# EAGLE schematic rev02 (EAGLE 7.5.0), part 2 of 2
## Sheet 19 of 26: FPGA voltage regulators
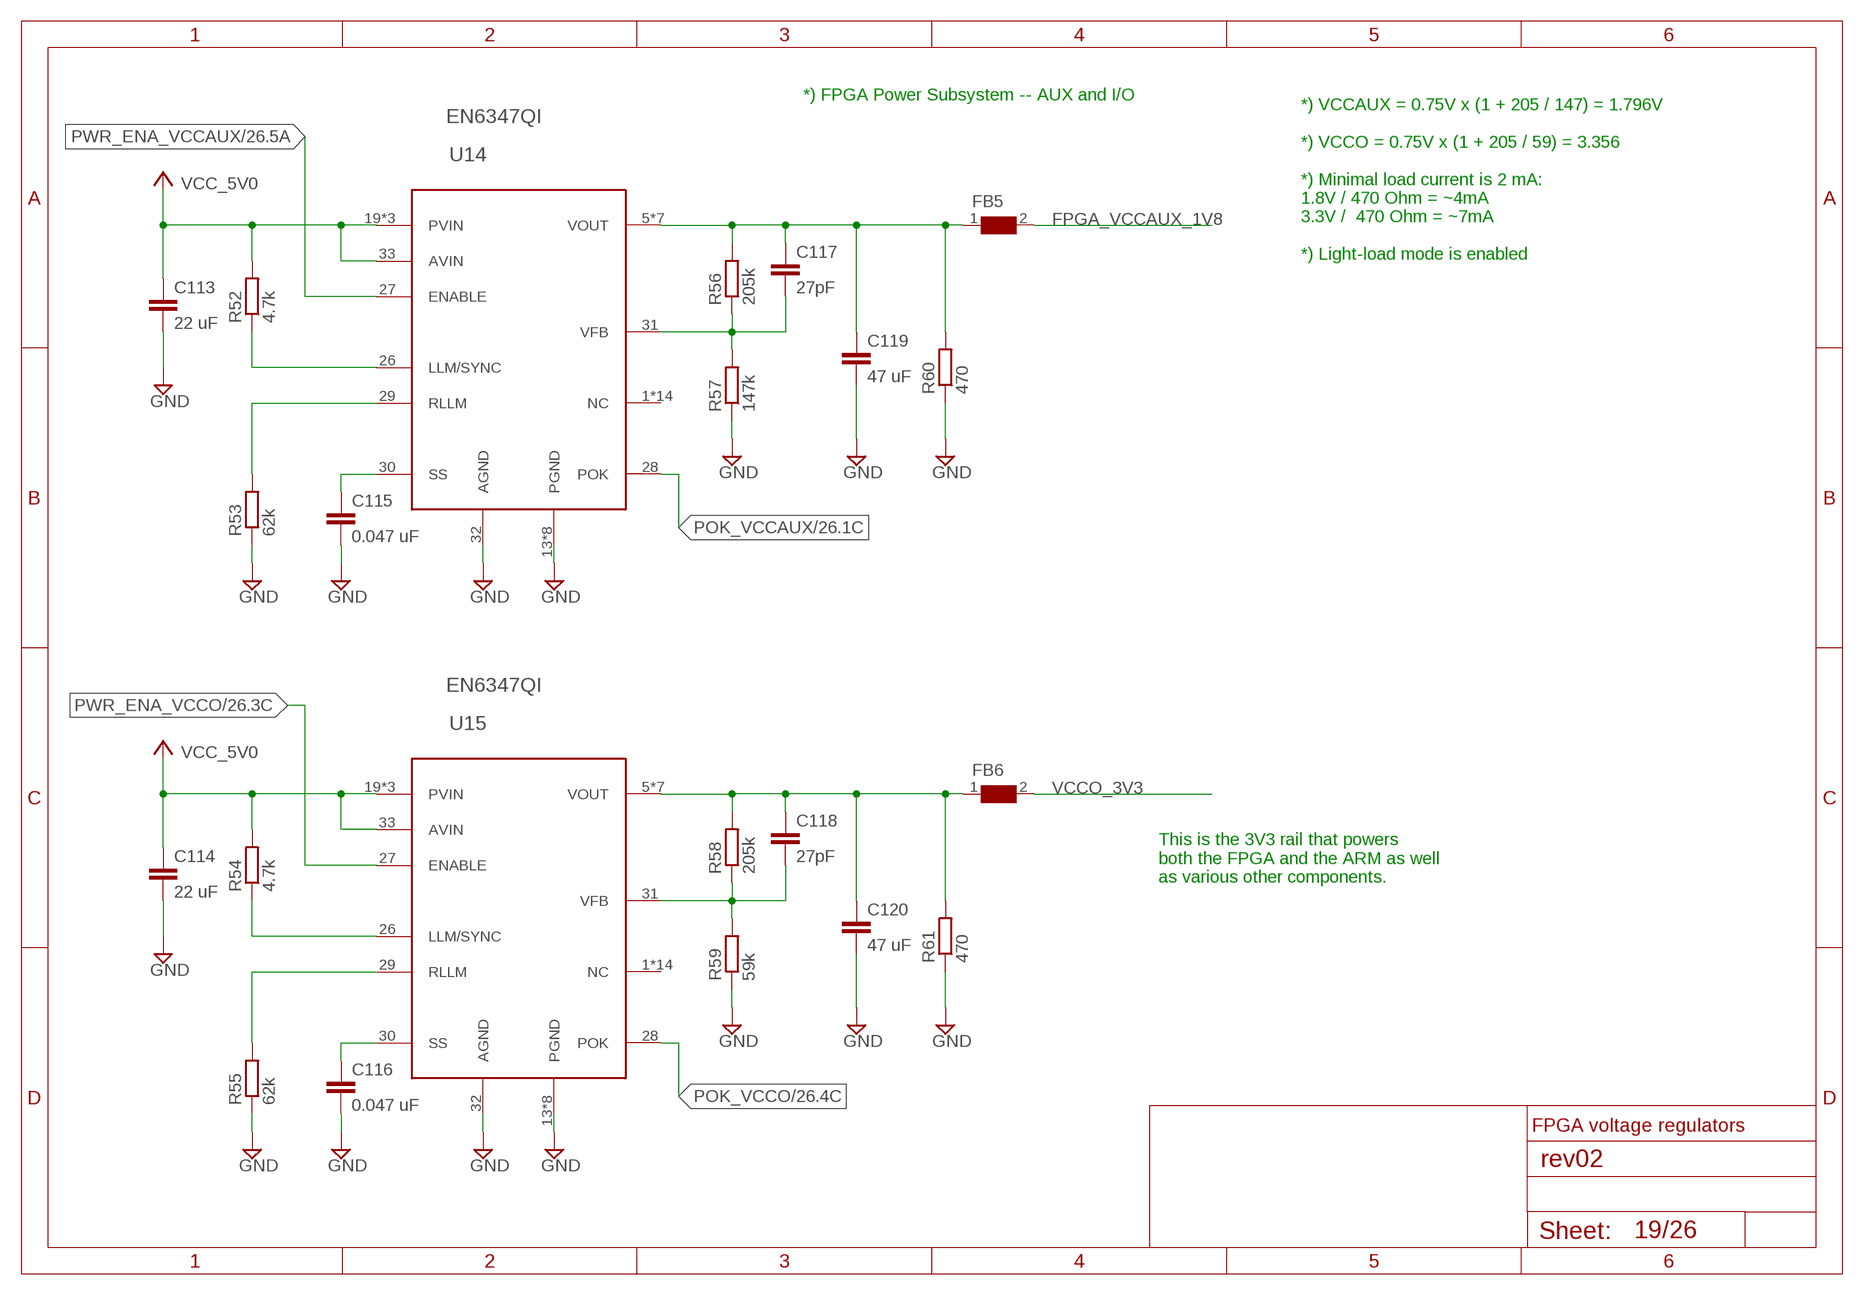
[diagram p18: schematic, sheet 19]

### Parts
C113  22 uF  C-EUC1210  [C1210]
C114  22 uF  C-EUC1210  [C1210]
C115  0.047 uF  C-EUC0402  [C0402]
C116  0.047 uF  C-EUC0402  [C0402]
C117  27pF  C-EUC0402  [C0402]
C118  27pF  C-EUC0402  [C0402]
C119  47 uF  C-EUC1210  [C1210]
C120  47 uF  C-EUC1210  [C1210]
FB5  0  BLM31PG330SN1_1206  [1206]
FB6  0  BLM31PG330SN1_1206  [1206]
R52  4.7k  R-EU_R0402  [R0402]
R53  62k  R-EU_R0402  [R0402]
R54  4.7k  R-EU_R0402  [R0402]
R55  62k  R-EU_R0402  [R0402]
R56  205k  R-EU_R0402  [R0402]
R57  147k  R-EU_R0402  [R0402]
R58  205k  R-EU_R0402  [R0402]
R59  59k  R-EU_R0402  [R0402]
R60  470  R-EU_R0402  [R0402]
R61  470  R-EU_R0402  [R0402]
U14  EN6347QI  [QFN38_4X7X1.85]
U15  EN6347QI  [QFN38_4X7X1.85]

### Nets
FPGA_VCCAUX_1V8: FB5.2 ; also sheet 15,22,23
GND [Ground]: C113.2 C114.2 C115.2 C116.2 C119.2 C120.2 R53.1 R55.1 R57.1 R59.1 R60.1 R61.1 U14.13(PGND) U14.14(PGND) U14.15(PGND) U14.16(PGND) U14.17(PGND) U14.18(PGND) U14.32(AGND) U14.P$39(PGND) U14.P$40(PGND) U15.13(PGND) U15.14(PGND) U15.15(PGND) U15.16(PGND) U15.17(PGND) U15.18(PGND) U15.32(AGND) U15.P$39(PGND) U15.P$40(PGND) ; also sheet 2,3,4,5,7,8,9,10,11,12,13,14,15,16,20,22,23,24,25,26
N$35: C115.1 U14.30(SS)
N$36: R53.2 U14.29(RLLM)
N$37: R52.1 U14.26(LLM/SYNC)
N$38: C117.1 C119.1 FB5.1 R56.2 R60.2 U14.5(VOUT) U14.6(VOUT) U14.7(VOUT) U14.8(VOUT) U14.9(VOUT) U14.10(VOUT) U14.11(VOUT)
N$39: C117.2 R56.1 R57.2 U14.31(VFB)
N$40: C116.1 U15.30(SS)
N$41: R55.2 U15.29(RLLM)
N$42: R54.1 U15.26(LLM/SYNC)
N$43: C118.1 C120.1 FB6.1 R58.2 R61.2 U15.5(VOUT) U15.6(VOUT) U15.7(VOUT) U15.8(VOUT) U15.9(VOUT) U15.10(VOUT) U15.11(VOUT)
N$44: C118.2 R58.1 R59.2 U15.31(VFB)
POK_VCCAUX: U14.28(POK) ; also sheet 26
POK_VCCO: U15.28(POK) ; also sheet 26
PWR_ENA_VCCAUX: U14.27(ENABLE) ; also sheet 26
PWR_ENA_VCCO: U15.27(ENABLE) ; also sheet 26
VCC_5V0: C113.1 C114.1 R52.2 R54.2 U14.19(PVIN) U14.20(PVIN) U14.21(PVIN) U14.33(AVIN) U15.19(PVIN) U15.20(PVIN) U15.21(PVIN) U15.33(AVIN) ; supply symbol labelled VCC ; also sheet 2,25,26
VCCO_3V3: FB6.2 ; also sheet 3,4,5,7,8,9,10,11,12,14,16,17,18,20,21,24
Unconnected: U14.1(NC) U14.2(NC) U14.3(NC) U14.4(NC) U14.12(NC) U14.22(NC) U14.23(NC) U14.24(NC) U14.25(NC) U14.34(NC) U14.35(NC) U14.36(NC) U14.37(NC) U14.38(NC) U15.1(NC) U15.2(NC) U15.3(NC) U15.4(NC) U15.12(NC) U15.22(NC) U15.23(NC) U15.24(NC) U15.25(NC) U15.34(NC) U15.35(NC) U15.36(NC) U15.37(NC) U15.38(NC)

### Notes on the sheet
- *) FPGA Power Subsystem -- AUX and I/O
- *) VCCAUX = 0.75V x (1 + 205 / 147) = 1.796V
  
  *) VCCO = 0.75V x (1 + 205 / 59) = 3.356
  
  *) Minimal load current is 2 mA:
  1.8V / 470 Ohm = ~4mA
  3.3V /  470 Ohm = ~7mA
  
  *) Light-load mode is enabled
- This is the 3V3 rail that powers
  both the FPGA and the ARM as well
  as various other components.
- FPGA voltage regulators

## Sheet 20 of 26: FPGA GPIO
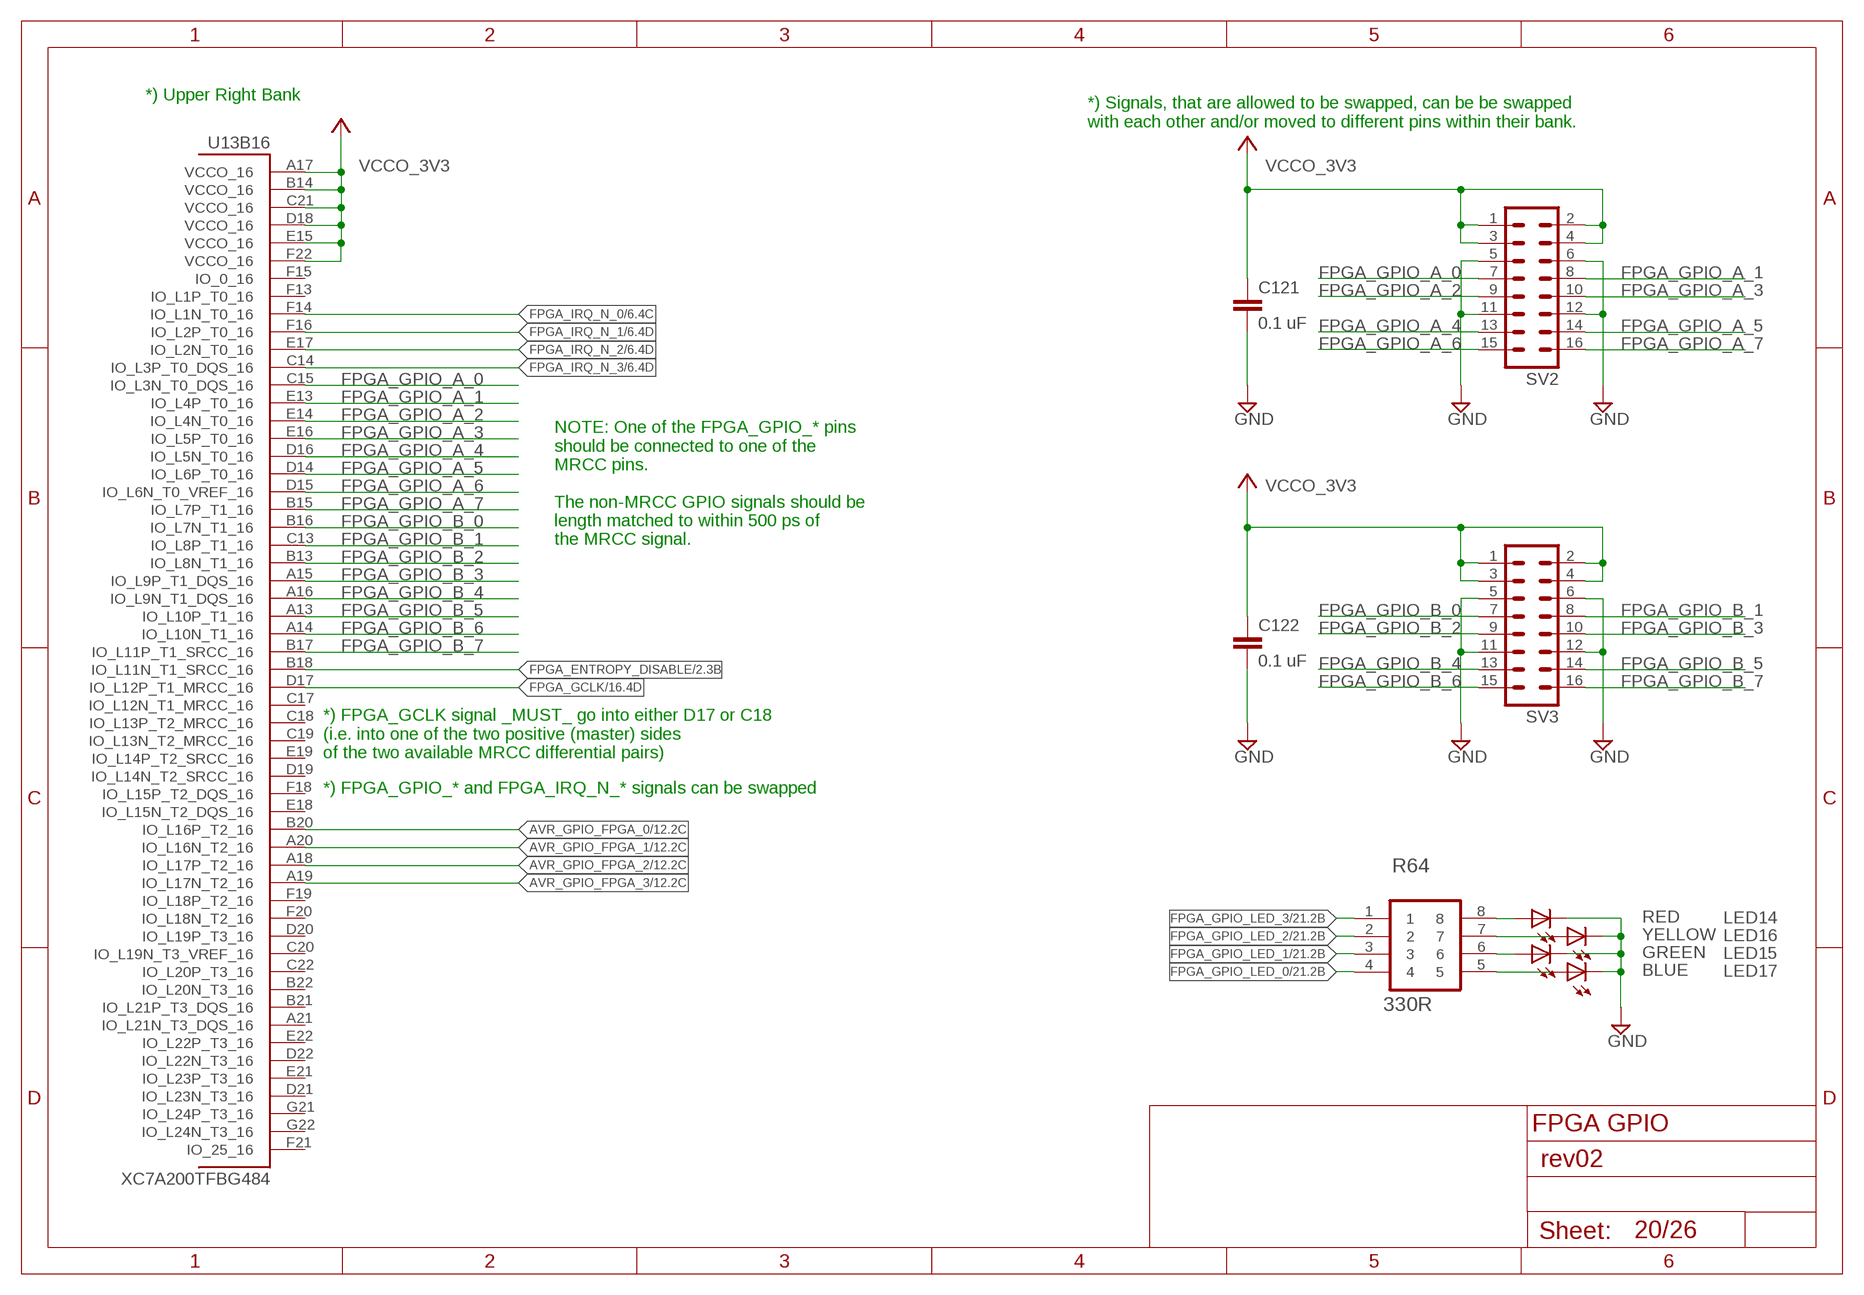
[diagram p19: schematic, sheet 20]

### Parts
C121  0.1 uF  C-EUC0402  [C0402]
C122  0.1 uF  C-EUC0402  [C0402]
LED14  RED  LEDCHIP-LED0603  [CHIP-LED0603]
LED15  GREEN  LEDCHIP-LED0603  [CHIP-LED0603]
LED16  YELLOW  LEDCHIP-LED0603  [CHIP-LED0603]
LED17  BLUE  LEDCHIP-LED0603  [CHIP-LED0603]
R64  330R  EXB38V331JV  [RESCAXE80P320X160X60-8N]
SV2  MA08-2  [MA08-2]
SV3  MA08-2  [MA08-2]

### Nets
FPGA_ENTROPY_DISABLE: U13.B18(B16:IO_L11N_T1_SRCC_16) ; also sheet 2
FPGA_GCLK: U13.D17(B16:IO_L12P_T1_MRCC_16) ; also sheet 16
FPGA_GPIO_A_0: SV2.7 U13.C15(B16:IO_L3N_T0_DQS_16)
FPGA_GPIO_A_1: SV2.8 U13.E13(B16:IO_L4P_T0_16)
FPGA_GPIO_A_2: SV2.9 U13.E14(B16:IO_L4N_T0_16)
FPGA_GPIO_A_3: SV2.10 U13.E16(B16:IO_L5P_T0_16)
FPGA_GPIO_A_4: SV2.13 U13.D16(B16:IO_L5N_T0_16)
FPGA_GPIO_A_5: SV2.14 U13.D14(B16:IO_L6P_T0_16)
FPGA_GPIO_A_6: SV2.15 U13.D15(B16:IO_L6N_T0_VREF_16)
FPGA_GPIO_A_7: SV2.16 U13.B15(B16:IO_L7P_T1_16)
FPGA_GPIO_B_0: SV3.7 U13.B16(B16:IO_L7N_T1_16)
FPGA_GPIO_B_1: SV3.8 U13.C13(B16:IO_L8P_T1_16)
FPGA_GPIO_B_2: SV3.9 U13.B13(B16:IO_L8N_T1_16)
FPGA_GPIO_B_3: SV3.10 U13.A15(B16:IO_L9P_T1_DQS_16)
FPGA_GPIO_B_4: SV3.13 U13.A16(B16:IO_L9N_T1_DQS_16)
FPGA_GPIO_B_5: SV3.14 U13.A13(B16:IO_L10P_T1_16)
FPGA_GPIO_B_6: SV3.15 U13.A14(B16:IO_L10N_T1_16)
FPGA_GPIO_B_7: SV3.16 U13.B17(B16:IO_L11P_T1_SRCC_16)
FPGA_GPIO_LED_0: R64.4 ; also sheet 21
FPGA_GPIO_LED_1: R64.3 ; also sheet 21
FPGA_GPIO_LED_2: R64.2 ; also sheet 21
FPGA_GPIO_LED_3: R64.1 ; also sheet 21
FPGA_IRQ_N_0: U13.F14(B16:IO_L1N_T0_16) ; also sheet 6
FPGA_IRQ_N_1: U13.F16(B16:IO_L2P_T0_16) ; also sheet 6
FPGA_IRQ_N_2: U13.E17(B16:IO_L2N_T0_16) ; also sheet 6
FPGA_IRQ_N_3: U13.C14(B16:IO_L3P_T0_DQS_16) ; also sheet 6
GND [Ground]: C121.2 C122.2 LED14.C LED15.C LED16.C LED17.C SV2.5 SV2.6 SV2.11 SV2.12 SV3.5 SV3.6 SV3.11 SV3.12 ; also sheet 2,3,4,5,7,8,9,10,11,12,13,14,15,16,19,22,23,24,25,26
N$27: LED17.A R64.5
N$28: LED15.A R64.6
N$29: LED16.A R64.7
N$30: LED14.A R64.8
VCCO_3V3: C121.1 C122.1 SV2.1 SV2.2 SV2.3 SV2.4 SV3.1 SV3.2 SV3.3 SV3.4 U13.A17(B16:VCCO_16) U13.B14(B16:VCCO_16) U13.C21(B16:VCCO_16) U13.D18(B16:VCCO_16) U13.E15(B16:VCCO_16) U13.F22(B16:VCCO_16) ; supply symbol labelled VCC ; also sheet 3,4,5,7,8,9,10,11,12,14,16,17,18,19,21,24
Unconnected: U13.A18(B16:IO_L17P_T2_16) U13.A19(B16:IO_L17N_T2_16) U13.A20(B16:IO_L16N_T2_16) U13.A21(B16:IO_L21N_T3_DQS_16) U13.B20(B16:IO_L16P_T2_16) U13.B21(B16:IO_L21P_T3_DQS_16) U13.B22(B16:IO_L20N_T3_16) U13.C17(B16:IO_L12N_T1_MRCC_16) U13.C18(B16:IO_L13P_T2_MRCC_16) U13.C19(B16:IO_L13N_T2_MRCC_16) U13.C20(B16:IO_L19N_T3_VREF_16) U13.C22(B16:IO_L20P_T3_16) U13.D19(B16:IO_L14N_T2_SRCC_16) U13.D20(B16:IO_L19P_T3_16) U13.D21(B16:IO_L23N_T3_16) U13.D22(B16:IO_L22N_T3_16) U13.E18(B16:IO_L15N_T2_DQS_16) U13.E19(B16:IO_L14P_T2_SRCC_16) U13.E21(B16:IO_L23P_T3_16) U13.E22(B16:IO_L22P_T3_16) U13.F13(B16:IO_L1P_T0_16) U13.F15(B16:IO_0_16) U13.F18(B16:IO_L15P_T2_DQS_16) U13.F19(B16:IO_L18P_T2_16) U13.F20(B16:IO_L18N_T2_16) U13.F21(B16:IO_25_16) U13.G21(B16:IO_L24P_T3_16) U13.G22(B16:IO_L24N_T3_16)

### Notes on the sheet
- *) Upper Right Bank
- *) Signals, that are allowed to be swapped, can be be swapped
  with each other and/or moved to different pins within their bank.
- NOTE: One of the FPGA_GPIO_* pins
  should be connected to one of the
  MRCC pins.
  
  The non-MRCC GPIO signals should be
  length matched to within 500 ps of
  the MRCC signal.
- *) FPGA_GCLK signal _MUST_ go into either D17 or C18
  (i.e. into one of the two positive (master) sides
  of the two available MRCC differential pairs)
- *) FPGA_GPIO_* and FPGA_IRQ_N_* signals can be swapped
- FPGA GPIO

## Sheet 21 of 26: FPGA MKM interface
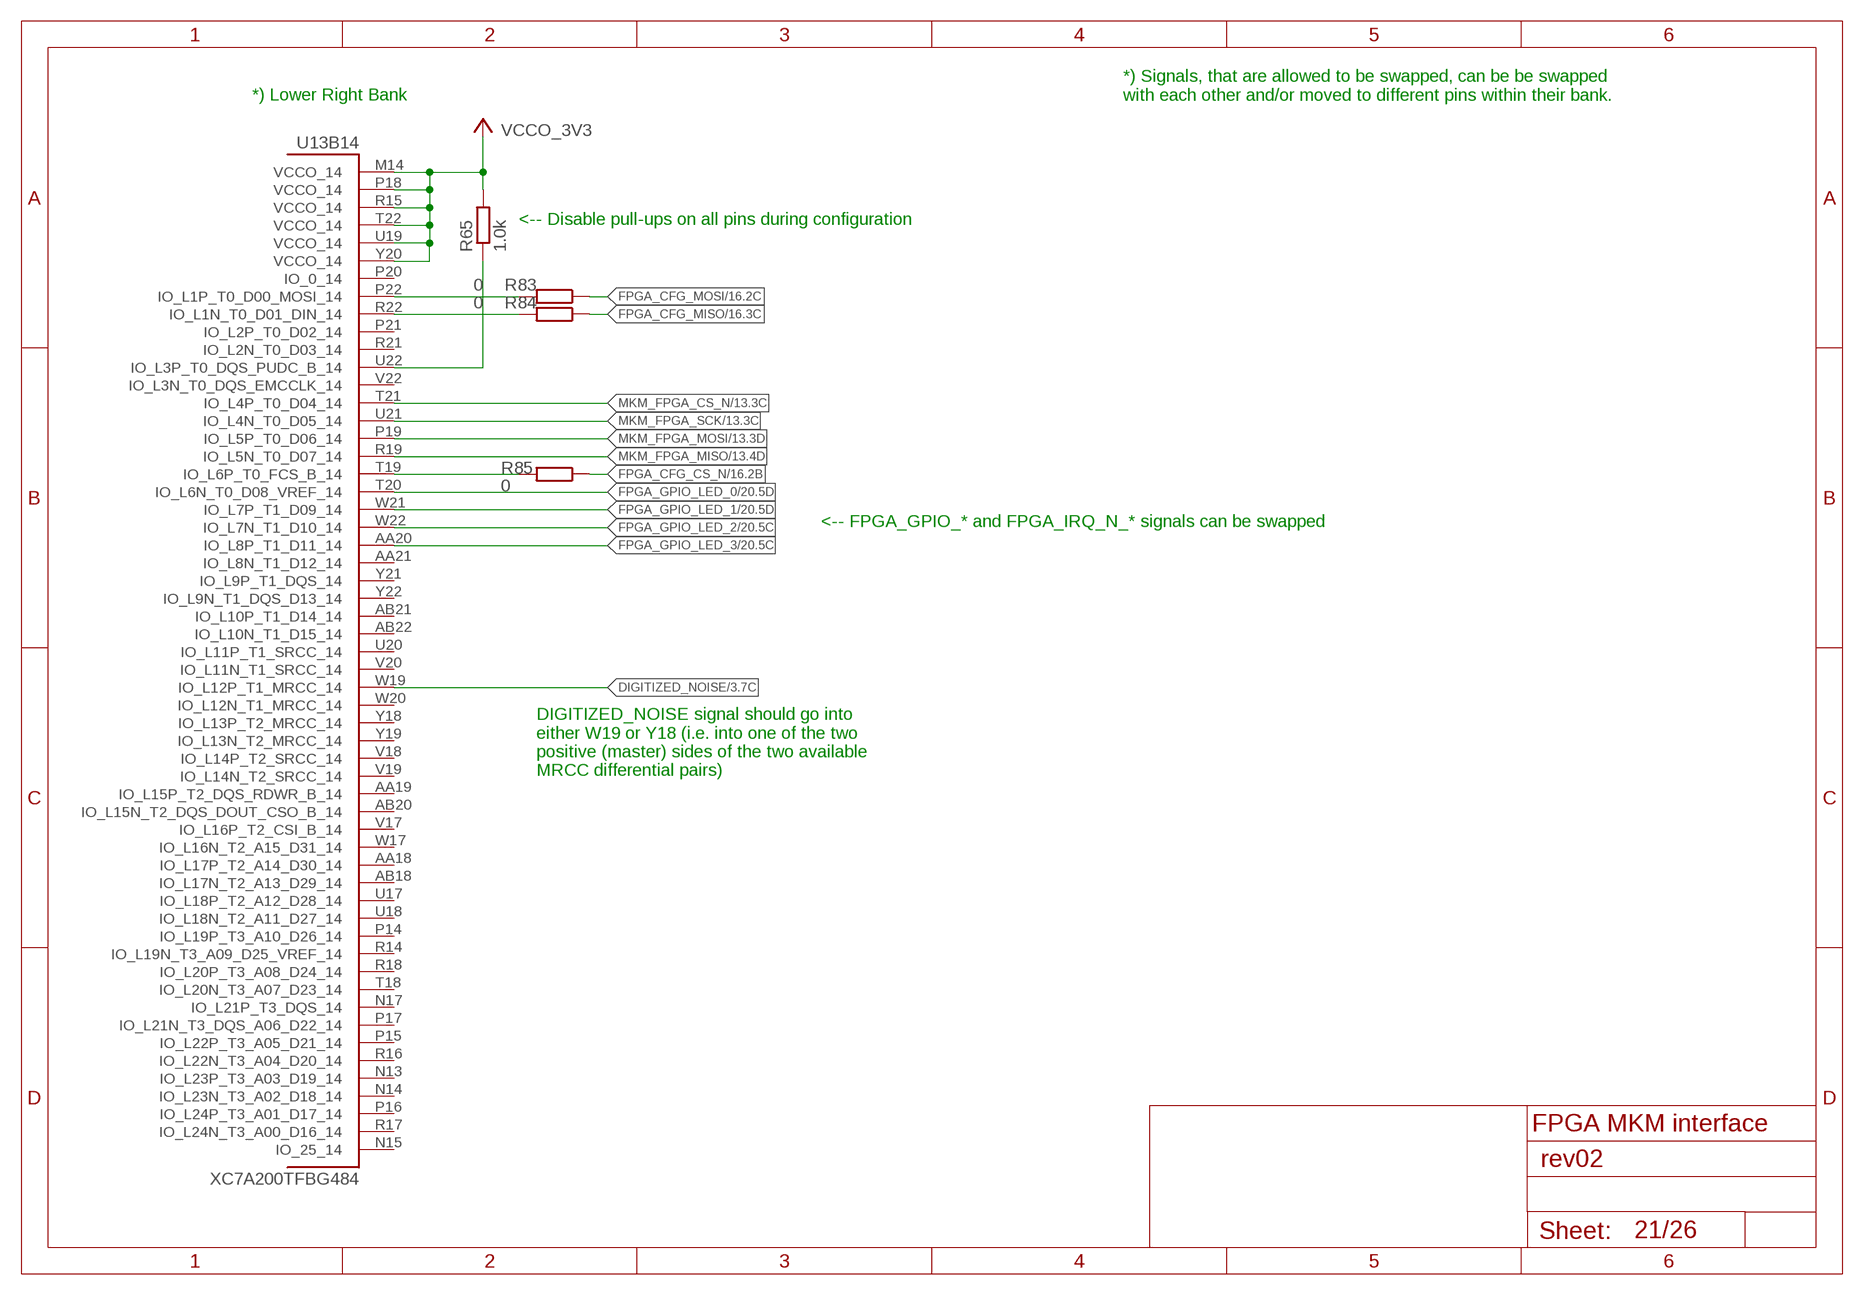
[diagram p20: schematic, sheet 21]

### Parts
R65  1.0k  R-EU_R0402  [R0402]
R83  0  R-EU_R0603  [R0603]
R84  0  R-EU_R0603  [R0603]
R85  0  R-EU_R0603  [R0603]

### Nets
DIGITIZED_NOISE: U13.W19(B14:IO_L12P_T1_MRCC_14) ; also sheet 3
FPGA_CFG_CS_N: R85.1 ; also sheet 16
FPGA_CFG_CS_N1: R85.2 U13.T19(B14:IO_L6P_T0_FCS_B_14)
FPGA_CFG_MISO: R84.1 ; also sheet 16
FPGA_CFG_MISO1: R84.2 U13.R22(B14:IO_L1N_T0_D01_DIN_14)
FPGA_CFG_MOSI: R83.1 ; also sheet 16
FPGA_CFG_MOSI1: R83.2 U13.P22(B14:IO_L1P_T0_D00_MOSI_14)
FPGA_GPIO_LED_0: U13.T20(B14:IO_L6N_T0_D08_VREF_14) ; also sheet 20
FPGA_GPIO_LED_1: U13.W21(B14:IO_L7P_T1_D09_14) ; also sheet 20
FPGA_GPIO_LED_2: U13.W22(B14:IO_L7N_T1_D10_14) ; also sheet 20
FPGA_GPIO_LED_3: U13.AA20(B14:IO_L8P_T1_D11_14) ; also sheet 20
MKM_FPGA_CS_N: U13.T21(B14:IO_L4P_T0_D04_14) ; also sheet 13
MKM_FPGA_MISO: U13.R19(B14:IO_L5N_T0_D07_14) ; also sheet 13
MKM_FPGA_MOSI: U13.P19(B14:IO_L5P_T0_D06_14) ; also sheet 13
MKM_FPGA_SCK: U13.U21(B14:IO_L4N_T0_D05_14) ; also sheet 13
N$32: R65.1 U13.U22(B14:IO_L3P_T0_DQS_PUDC_B_14)
VCCO_3V3: R65.2 U13.M14(B14:VCCO_14) U13.P18(B14:VCCO_14) U13.R15(B14:VCCO_14) U13.T22(B14:VCCO_14) U13.U19(B14:VCCO_14) U13.Y20(B14:VCCO_14) ; supply symbol labelled VCC ; also sheet 3,4,5,7,8,9,10,11,12,14,16,17,18,19,20,24
Unconnected: U13.AA18(B14:IO_L17P_T2_A14_D30_14) U13.AA19(B14:IO_L15P_T2_DQS_RDWR_B_14) U13.AA21(B14:IO_L8N_T1_D12_14) U13.AB18(B14:IO_L17N_T2_A13_D29_14) U13.AB20(B14:IO_L15N_T2_DQS_DOUT_CSO_B_14) U13.AB21(B14:IO_L10P_T1_D14_14) U13.AB22(B14:IO_L10N_T1_D15_14) U13.N13(B14:IO_L23P_T3_A03_D19_14) U13.N14(B14:IO_L23N_T3_A02_D18_14) U13.N15(B14:IO_25_14) U13.N17(B14:IO_L21P_T3_DQS_14) U13.P14(B14:IO_L19P_T3_A10_D26_14) U13.P15(B14:IO_L22P_T3_A05_D21_14) U13.P16(B14:IO_L24P_T3_A01_D17_14) U13.P17(B14:IO_L21N_T3_DQS_A06_D22_14) U13.P20(B14:IO_0_14) U13.P21(B14:IO_L2P_T0_D02_14) U13.R14(B14:IO_L19N_T3_A09_D25_VREF_14) U13.R16(B14:IO_L22N_T3_A04_D20_14) U13.R17(B14:IO_L24N_T3_A00_D16_14) U13.R18(B14:IO_L20P_T3_A08_D24_14) U13.R21(B14:IO_L2N_T0_D03_14) U13.T18(B14:IO_L20N_T3_A07_D23_14) U13.U17(B14:IO_L18P_T2_A12_D28_14) U13.U18(B14:IO_L18N_T2_A11_D27_14) U13.U20(B14:IO_L11P_T1_SRCC_14) U13.V17(B14:IO_L16P_T2_CSI_B_14) U13.V18(B14:IO_L14P_T2_SRCC_14) U13.V19(B14:IO_L14N_T2_SRCC_14) U13.V20(B14:IO_L11N_T1_SRCC_14) U13.V22(B14:IO_L3N_T0_DQS_EMCCLK_14) U13.W17(B14:IO_L16N_T2_A15_D31_14) U13.W20(B14:IO_L12N_T1_MRCC_14) U13.Y18(B14:IO_L13P_T2_MRCC_14) U13.Y19(B14:IO_L13N_T2_MRCC_14) U13.Y21(B14:IO_L9P_T1_DQS_14) U13.Y22(B14:IO_L9N_T1_DQS_D13_14)

### Notes on the sheet
- *) Lower Right Bank
- *) Signals, that are allowed to be swapped, can be be swapped
  with each other and/or moved to different pins within their bank.
- <-- Disable pull-ups on all pins during configuration
- <-- FPGA_GPIO_* and FPGA_IRQ_N_* signals can be swapped
- DIGITIZED_NOISE signal should go into
  either W19 or Y18 (i.e. into one of the two
  positive (master) sides of the two available
  MRCC differential pairs)
- FPGA MKM interface

## Sheet 22 of 26: FPGA power and ground
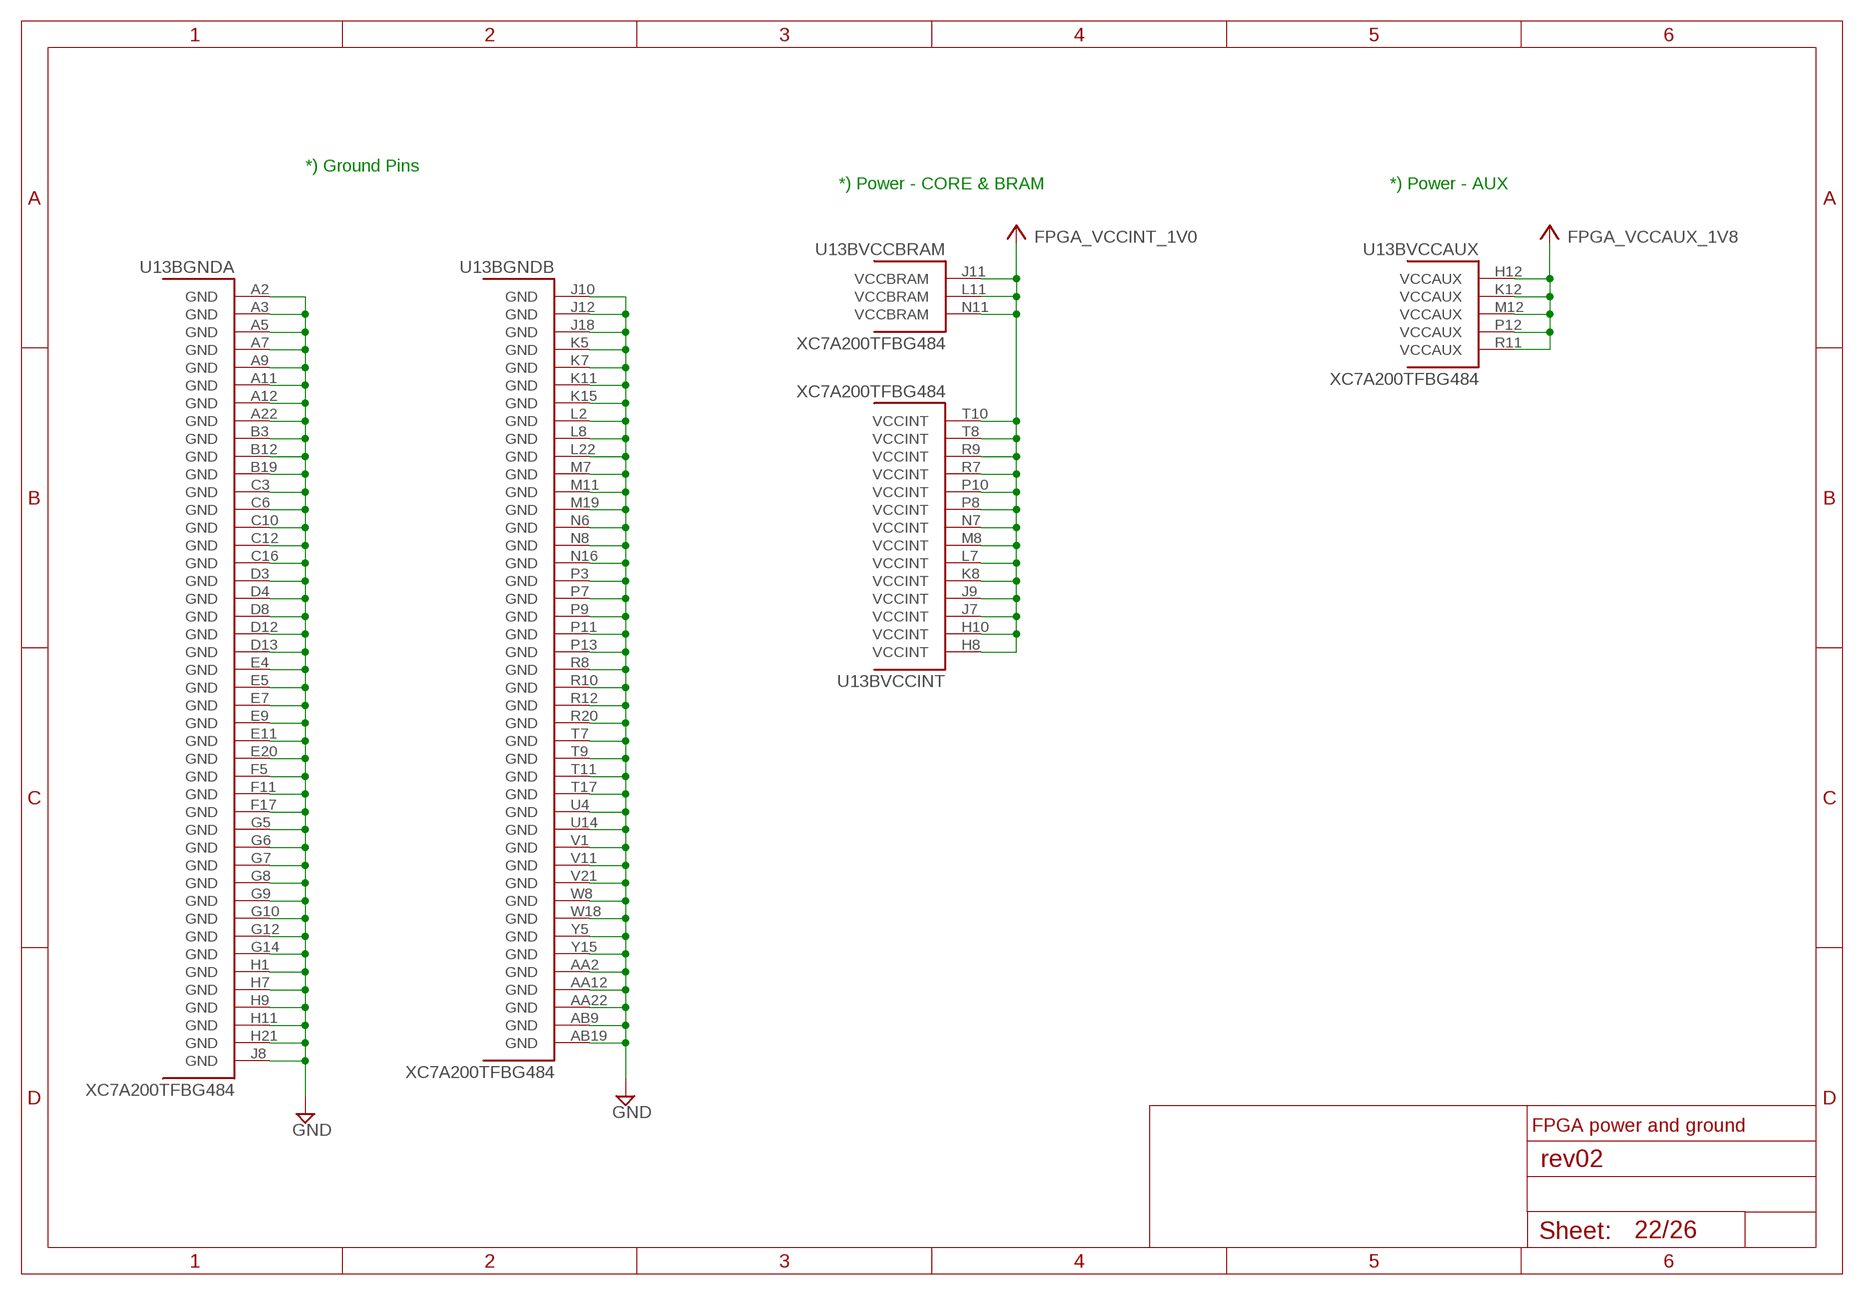
[diagram p21: schematic, sheet 22]

### Nets
FPGA_VCCAUX_1V8: U13.H12(BVCCAUX:VCCAUX) U13.K12(BVCCAUX:VCCAUX) U13.M12(BVCCAUX:VCCAUX) U13.P12(BVCCAUX:VCCAUX) U13.R11(BVCCAUX:VCCAUX) ; supply symbol labelled VCC ; also sheet 15,19,23
FPGA_VCCINT_1V0: U13.H8(BVCCINT:VCCINT) U13.H10(BVCCINT:VCCINT) U13.J7(BVCCINT:VCCINT) U13.J9(BVCCINT:VCCINT) U13.J11(BVCCBRAM:VCCBRAM) U13.K8(BVCCINT:VCCINT) U13.L7(BVCCINT:VCCINT) U13.L11(BVCCBRAM:VCCBRAM) U13.M8(BVCCINT:VCCINT) U13.N7(BVCCINT:VCCINT) U13.N11(BVCCBRAM:VCCBRAM) U13.P8(BVCCINT:VCCINT) U13.P10(BVCCINT:VCCINT) U13.R7(BVCCINT:VCCINT) U13.R9(BVCCINT:VCCINT) U13.T8(BVCCINT:VCCINT) U13.T10(BVCCINT:VCCINT) ; supply symbol labelled VCC ; also sheet 23,25
GND [Ground]: U13.A2(BGNDA:GND) U13.A3(BGNDA:GND) U13.A5(BGNDA:GND) U13.A7(BGNDA:GND) U13.A9(BGNDA:GND) U13.A11(BGNDA:GND) U13.A12(BGNDA:GND) U13.A22(BGNDA:GND) U13.AA2(BGNDB:GND) U13.AA12(BGNDB:GND) U13.AA22(BGNDB:GND) U13.AB9(BGNDB:GND) U13.AB19(BGNDB:GND) U13.B3(BGNDA:GND) U13.B12(BGNDA:GND) U13.B19(BGNDA:GND) U13.C3(BGNDA:GND) U13.C6(BGNDA:GND) U13.C10(BGNDA:GND) U13.C12(BGNDA:GND) U13.C16(BGNDA:GND) U13.D3(BGNDA:GND) U13.D4(BGNDA:GND) U13.D8(BGNDA:GND) U13.D12(BGNDA:GND) U13.D13(BGNDA:GND) U13.E4(BGNDA:GND) U13.E5(BGNDA:GND) U13.E7(BGNDA:GND) U13.E9(BGNDA:GND) U13.E11(BGNDA:GND) U13.E20(BGNDA:GND) U13.F5(BGNDA:GND) U13.F11(BGNDA:GND) U13.F17(BGNDA:GND) U13.G5(BGNDA:GND) U13.G6(BGNDA:GND) U13.G7(BGNDA:GND) U13.G8(BGNDA:GND) U13.G9(BGNDA:GND) U13.G10(BGNDA:GND) U13.G12(BGNDA:GND) U13.G14(BGNDA:GND) U13.H1(BGNDA:GND) U13.H7(BGNDA:GND) U13.H9(BGNDA:GND) U13.H11(BGNDA:GND) U13.H21(BGNDA:GND) U13.J8(BGNDA:GND) U13.J10(BGNDB:GND) U13.J12(BGNDB:GND) U13.J18(BGNDB:GND) U13.K5(BGNDB:GND) U13.K7(BGNDB:GND) U13.K11(BGNDB:GND) U13.K15(BGNDB:GND) U13.L2(BGNDB:GND) U13.L8(BGNDB:GND) U13.L22(BGNDB:GND) U13.M7(BGNDB:GND) U13.M11(BGNDB:GND) U13.M19(BGNDB:GND) U13.N6(BGNDB:GND) U13.N8(BGNDB:GND) U13.N16(BGNDB:GND) U13.P3(BGNDB:GND) U13.P7(BGNDB:GND) U13.P9(BGNDB:GND) U13.P11(BGNDB:GND) U13.P13(BGNDB:GND) U13.R8(BGNDB:GND) U13.R10(BGNDB:GND) U13.R12(BGNDB:GND) U13.R20(BGNDB:GND) U13.T7(BGNDB:GND) U13.T9(BGNDB:GND) U13.T11(BGNDB:GND) U13.T17(BGNDB:GND) U13.U4(BGNDB:GND) U13.U14(BGNDB:GND) U13.V1(BGNDB:GND) U13.V11(BGNDB:GND) U13.V21(BGNDB:GND) U13.W8(BGNDB:GND) U13.W18(BGNDB:GND) U13.Y5(BGNDB:GND) U13.Y15(BGNDB:GND) ; also sheet 2,3,4,5,7,8,9,10,11,12,13,14,15,16,19,20,23,24,25,26

### Notes on the sheet
- *) Ground Pins
- *) Power - CORE & BRAM | *) Power - AUX
- FPGA power and ground

## Sheet 23 of 26: FPGA CORE and AUX capacitors
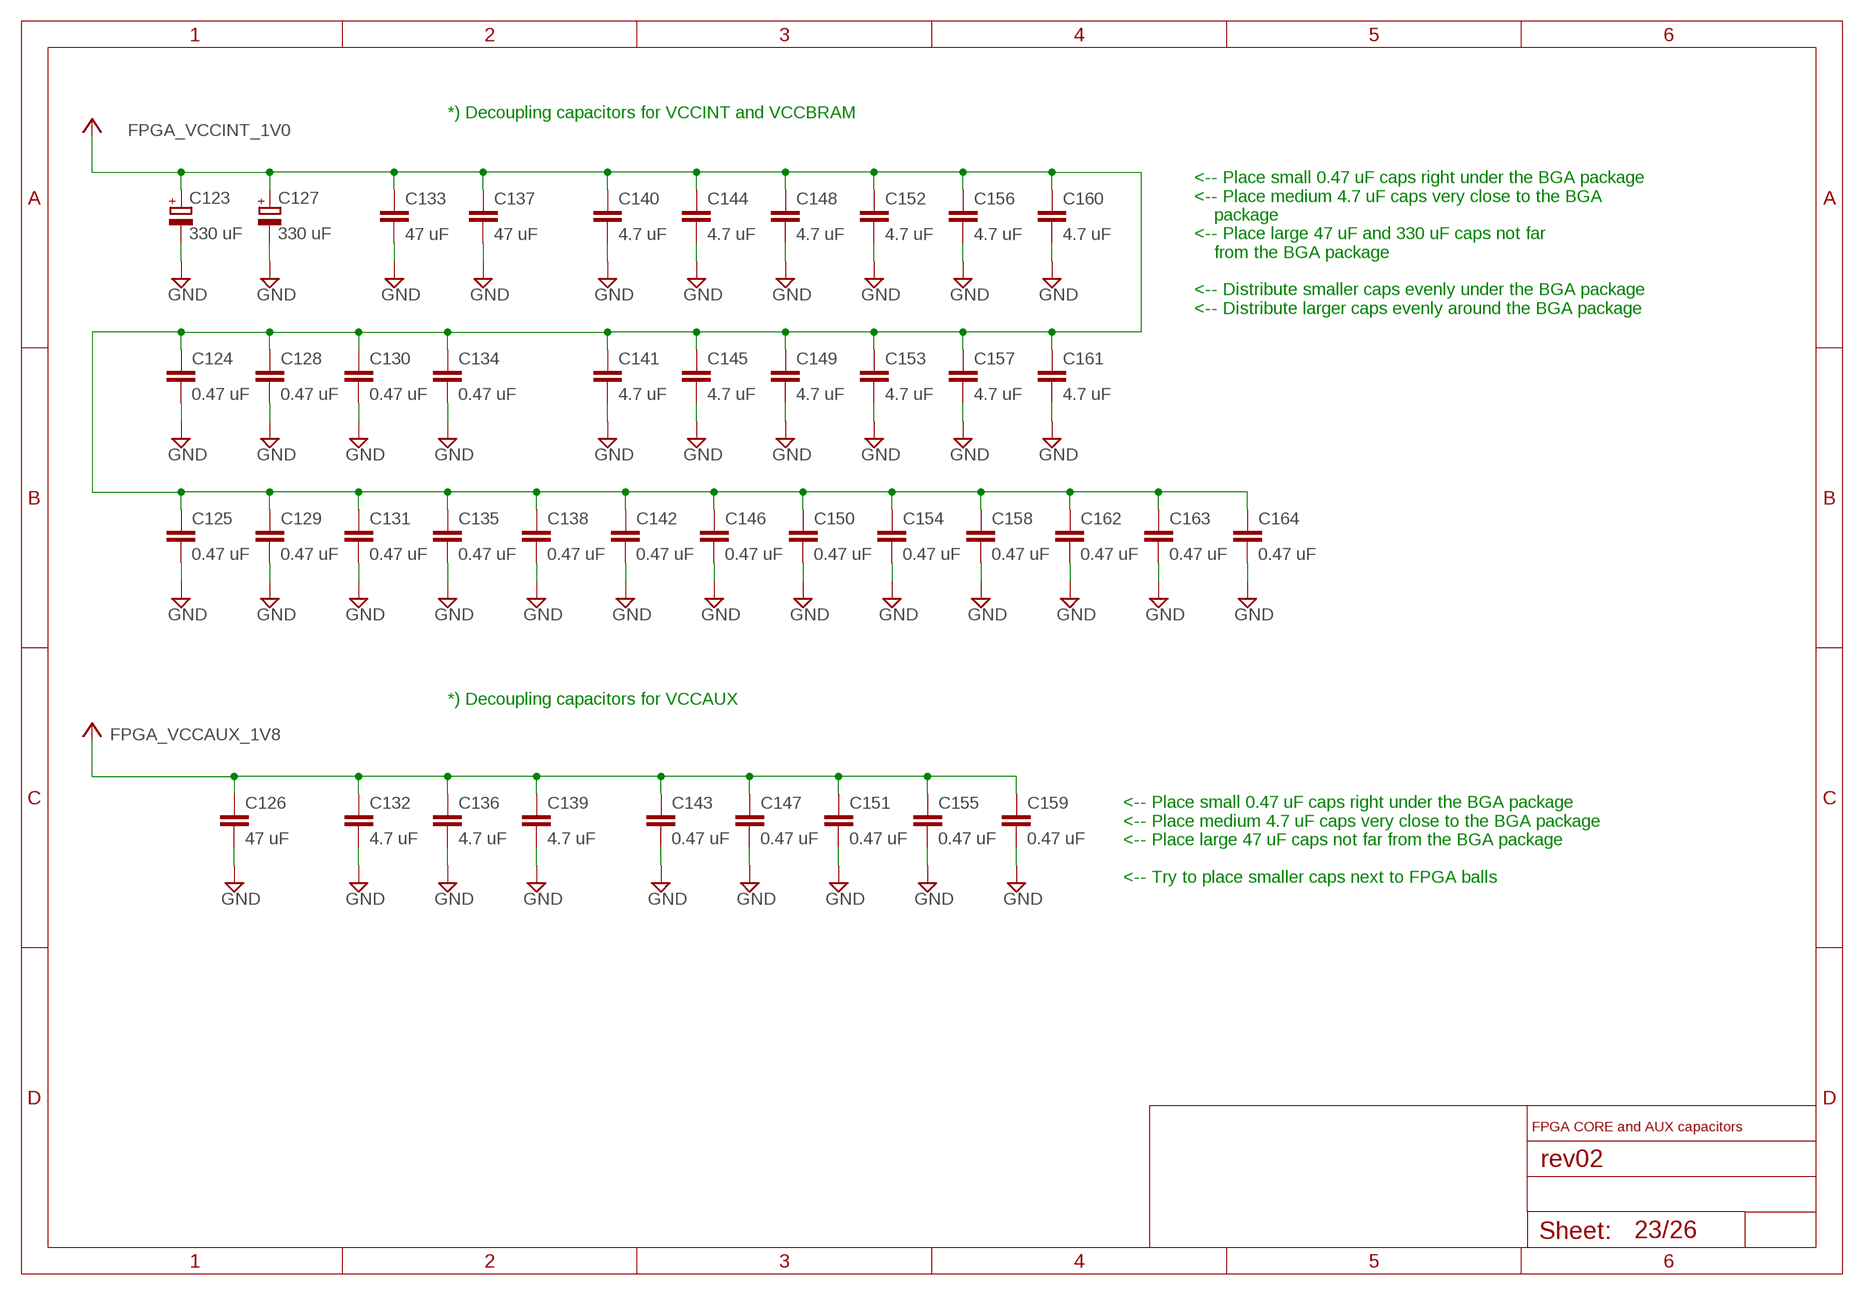
[diagram p22: schematic, sheet 23]

### Parts
C123  330 uF  CPOL-EUSMCD  [SMC_D]
C124  0.47 uF  C-EUC0402  [C0402]
C125  0.47 uF  C-EUC0402  [C0402]
C126  47 uF  C-EUC1210  [C1210]
C127  330 uF  CPOL-EUSMCD  [SMC_D]
C128  0.47 uF  C-EUC0402  [C0402]
C129  0.47 uF  C-EUC0402  [C0402]
C130  0.47 uF  C-EUC0402  [C0402]
C131  0.47 uF  C-EUC0402  [C0402]
C132  4.7 uF  C-EUC0603  [C0603]
C133  47 uF  C-EUC1210  [C1210]
C134  0.47 uF  C-EUC0402  [C0402]
C135  0.47 uF  C-EUC0402  [C0402]
C136  4.7 uF  C-EUC0603  [C0603]
C137  47 uF  C-EUC1210  [C1210]
C138  0.47 uF  C-EUC0402  [C0402]
C139  4.7 uF  C-EUC0603  [C0603]
C140  4.7 uF  C-EUC0603  [C0603]
C141  4.7 uF  C-EUC0603  [C0603]
C142  0.47 uF  C-EUC0402  [C0402]
C143  0.47 uF  C-EUC0402  [C0402]
C144  4.7 uF  C-EUC0603  [C0603]
C145  4.7 uF  C-EUC0603  [C0603]
C146  0.47 uF  C-EUC0402  [C0402]
C147  0.47 uF  C-EUC0402  [C0402]
C148  4.7 uF  C-EUC0603  [C0603]
C149  4.7 uF  C-EUC0603  [C0603]
C150  0.47 uF  C-EUC0402  [C0402]
C151  0.47 uF  C-EUC0402  [C0402]
C152  4.7 uF  C-EUC0603  [C0603]
C153  4.7 uF  C-EUC0603  [C0603]
C154  0.47 uF  C-EUC0402  [C0402]
C155  0.47 uF  C-EUC0402  [C0402]
C156  4.7 uF  C-EUC0603  [C0603]
C157  4.7 uF  C-EUC0603  [C0603]
C158  0.47 uF  C-EUC0402  [C0402]
C159  0.47 uF  C-EUC0402  [C0402]
C160  4.7 uF  C-EUC0603  [C0603]
C161  4.7 uF  C-EUC0603  [C0603]
C162  0.47 uF  C-EUC0402  [C0402]
C163  0.47 uF  C-EUC0402  [C0402]
C164  0.47 uF  C-EUC0402  [C0402]

### Nets
FPGA_VCCAUX_1V8: C126.1 C132.1 C136.1 C139.1 C143.1 C147.1 C151.1 C155.1 C159.1 ; supply symbol labelled VCC ; also sheet 15,19,22
FPGA_VCCINT_1V0: C123.+ C124.1 C125.1 C127.+ C128.1 C129.1 C130.1 C131.1 C133.1 C134.1 C135.1 C137.1 C138.1 C140.1 C141.1 C142.1 C144.1 C145.1 C146.1 C148.1 C149.1 C150.1 C152.1 C153.1 C154.1 C156.1 C157.1 C158.1 C160.1 C161.1 C162.1 C163.1 C164.1 ; supply symbol labelled VCC ; also sheet 22,25
GND [Ground]: C123.- C124.2 C125.2 C126.2 C127.- C128.2 C129.2 C130.2 C131.2 C132.2 C133.2 C134.2 C135.2 C136.2 C137.2 C138.2 C139.2 C140.2 C141.2 C142.2 C143.2 C144.2 C145.2 C146.2 C147.2 C148.2 C149.2 C150.2 C151.2 C152.2 C153.2 C154.2 C155.2 C156.2 C157.2 C158.2 C159.2 C160.2 C161.2 C162.2 C163.2 C164.2 ; also sheet 2,3,4,5,7,8,9,10,11,12,13,14,15,16,19,20,22,24,25,26

### Notes on the sheet
- *) Decoupling capacitors for VCCINT and VCCBRAM
- <-- Place small 0.47 uF caps right under the BGA package
  <-- Place medium 4.7 uF caps very close to the BGA
      package
  <-- Place large 47 uF and 330 uF caps not far
      from the BGA package
  
  <-- Distribute smaller caps evenly under the BGA package
  <-- Distribute larger caps evenly around the BGA package
- *) Decoupling capacitors for VCCAUX
- <-- Place small 0.47 uF caps right under the BGA package
  <-- Place medium 4.7 uF caps very close to the BGA package
  <-- Place large 47 uF caps not far from the BGA package
  
  <-- Try to place smaller caps next to FPGA balls
- FPGA CORE and AUX capacitors

## Sheet 24 of 26: FPGA VCCO bypass capacitors
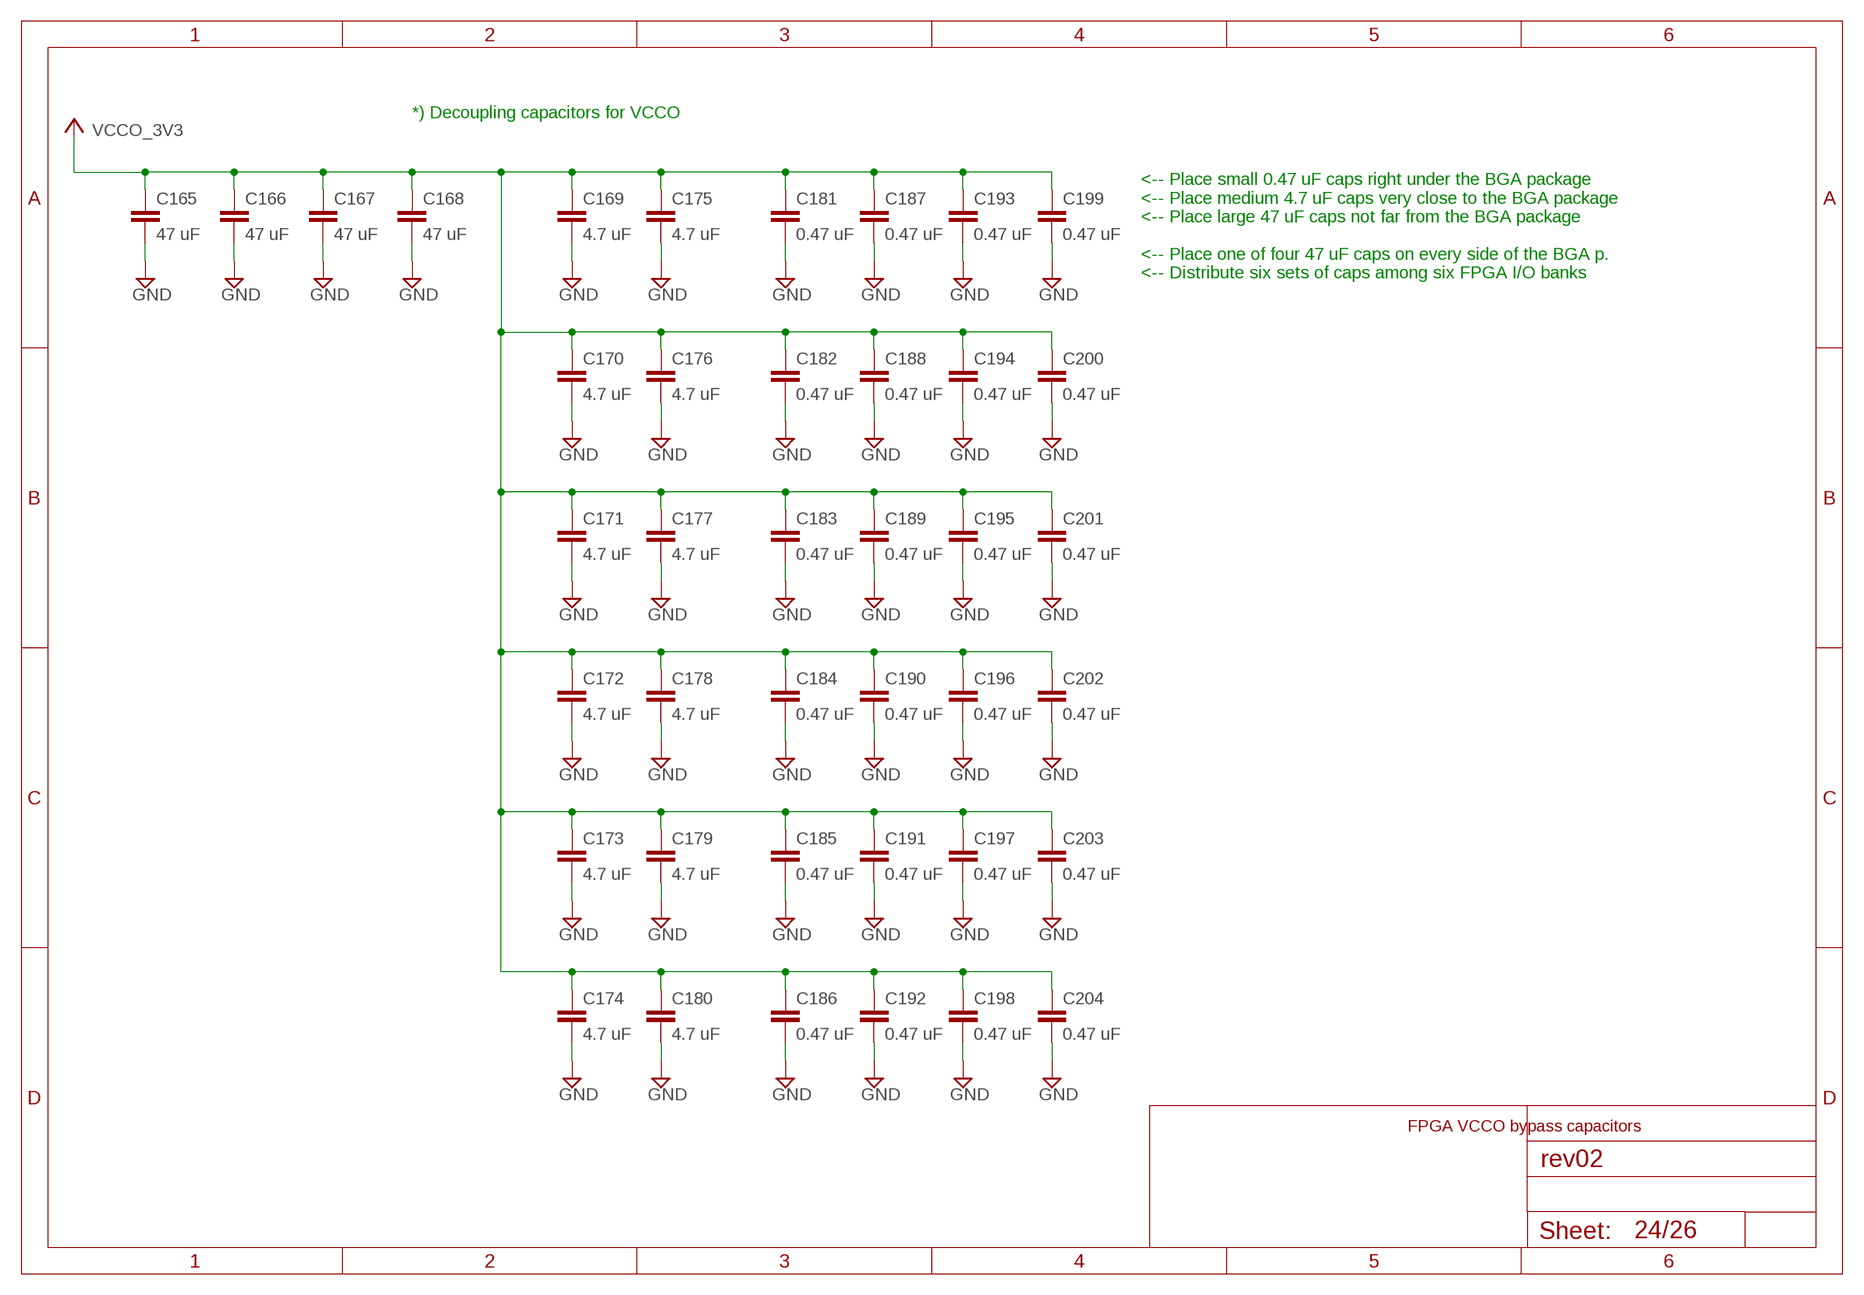
[diagram p23: schematic, sheet 24]

### Parts
C165  47 uF  C-EUC1210  [C1210]
C166  47 uF  C-EUC1210  [C1210]
C167  47 uF  C-EUC1210  [C1210]
C168  47 uF  C-EUC1210  [C1210]
C169  4.7 uF  C-EUC0603  [C0603]
C170  4.7 uF  C-EUC0603  [C0603]
C171  4.7 uF  C-EUC0603  [C0603]
C172  4.7 uF  C-EUC0603  [C0603]
C173  4.7 uF  C-EUC0603  [C0603]
C174  4.7 uF  C-EUC0603  [C0603]
C175  4.7 uF  C-EUC0603  [C0603]
C176  4.7 uF  C-EUC0603  [C0603]
C177  4.7 uF  C-EUC0603  [C0603]
C178  4.7 uF  C-EUC0603  [C0603]
C179  4.7 uF  C-EUC0603  [C0603]
C180  4.7 uF  C-EUC0603  [C0603]
C181  0.47 uF  C-EUC0402  [C0402]
C182  0.47 uF  C-EUC0402  [C0402]
C183  0.47 uF  C-EUC0402  [C0402]
C184  0.47 uF  C-EUC0402  [C0402]
C185  0.47 uF  C-EUC0402  [C0402]
C186  0.47 uF  C-EUC0402  [C0402]
C187  0.47 uF  C-EUC0402  [C0402]
C188  0.47 uF  C-EUC0402  [C0402]
C189  0.47 uF  C-EUC0402  [C0402]
C190  0.47 uF  C-EUC0402  [C0402]
C191  0.47 uF  C-EUC0402  [C0402]
C192  0.47 uF  C-EUC0402  [C0402]
C193  0.47 uF  C-EUC0402  [C0402]
C194  0.47 uF  C-EUC0402  [C0402]
C195  0.47 uF  C-EUC0402  [C0402]
C196  0.47 uF  C-EUC0402  [C0402]
C197  0.47 uF  C-EUC0402  [C0402]
C198  0.47 uF  C-EUC0402  [C0402]
C199  0.47 uF  C-EUC0402  [C0402]
C200  0.47 uF  C-EUC0402  [C0402]
C201  0.47 uF  C-EUC0402  [C0402]
C202  0.47 uF  C-EUC0402  [C0402]
C203  0.47 uF  C-EUC0402  [C0402]
C204  0.47 uF  C-EUC0402  [C0402]

### Nets
GND [Ground]: C165.2 C166.2 C167.2 C168.2 C169.2 C170.2 C171.2 C172.2 C173.2 C174.2 C175.2 C176.2 C177.2 C178.2 C179.2 C180.2 C181.2 C182.2 C183.2 C184.2 C185.2 C186.2 C187.2 C188.2 C189.2 C190.2 C191.2 C192.2 C193.2 C194.2 C195.2 C196.2 C197.2 C198.2 C199.2 C200.2 C201.2 C202.2 C203.2 C204.2 ; also sheet 2,3,4,5,7,8,9,10,11,12,13,14,15,16,19,20,22,23,25,26
VCCO_3V3: C165.1 C166.1 C167.1 C168.1 C169.1 C170.1 C171.1 C172.1 C173.1 C174.1 C175.1 C176.1 C177.1 C178.1 C179.1 C180.1 C181.1 C182.1 C183.1 C184.1 C185.1 C186.1 C187.1 C188.1 C189.1 C190.1 C191.1 C192.1 C193.1 C194.1 C195.1 C196.1 C197.1 C198.1 C199.1 C200.1 C201.1 C202.1 C203.1 C204.1 ; supply symbol labelled VCC ; also sheet 3,4,5,7,8,9,10,11,12,14,16,17,18,19,20,21

### Notes on the sheet
- *) Decoupling capacitors for VCCO
- <-- Place small 0.47 uF caps right under the BGA package
  <-- Place medium 4.7 uF caps very close to the BGA package
  <-- Place large 47 uF caps not far from the BGA package
  
  <-- Place one of four 47 uF caps on every side of the BGA p.
  <-- Distribute six sets of caps among six FPGA I/O banks
- FPGA VCCO bypass capacitors

## Sheet 25 of 26: FPGA CORE voltage regulator
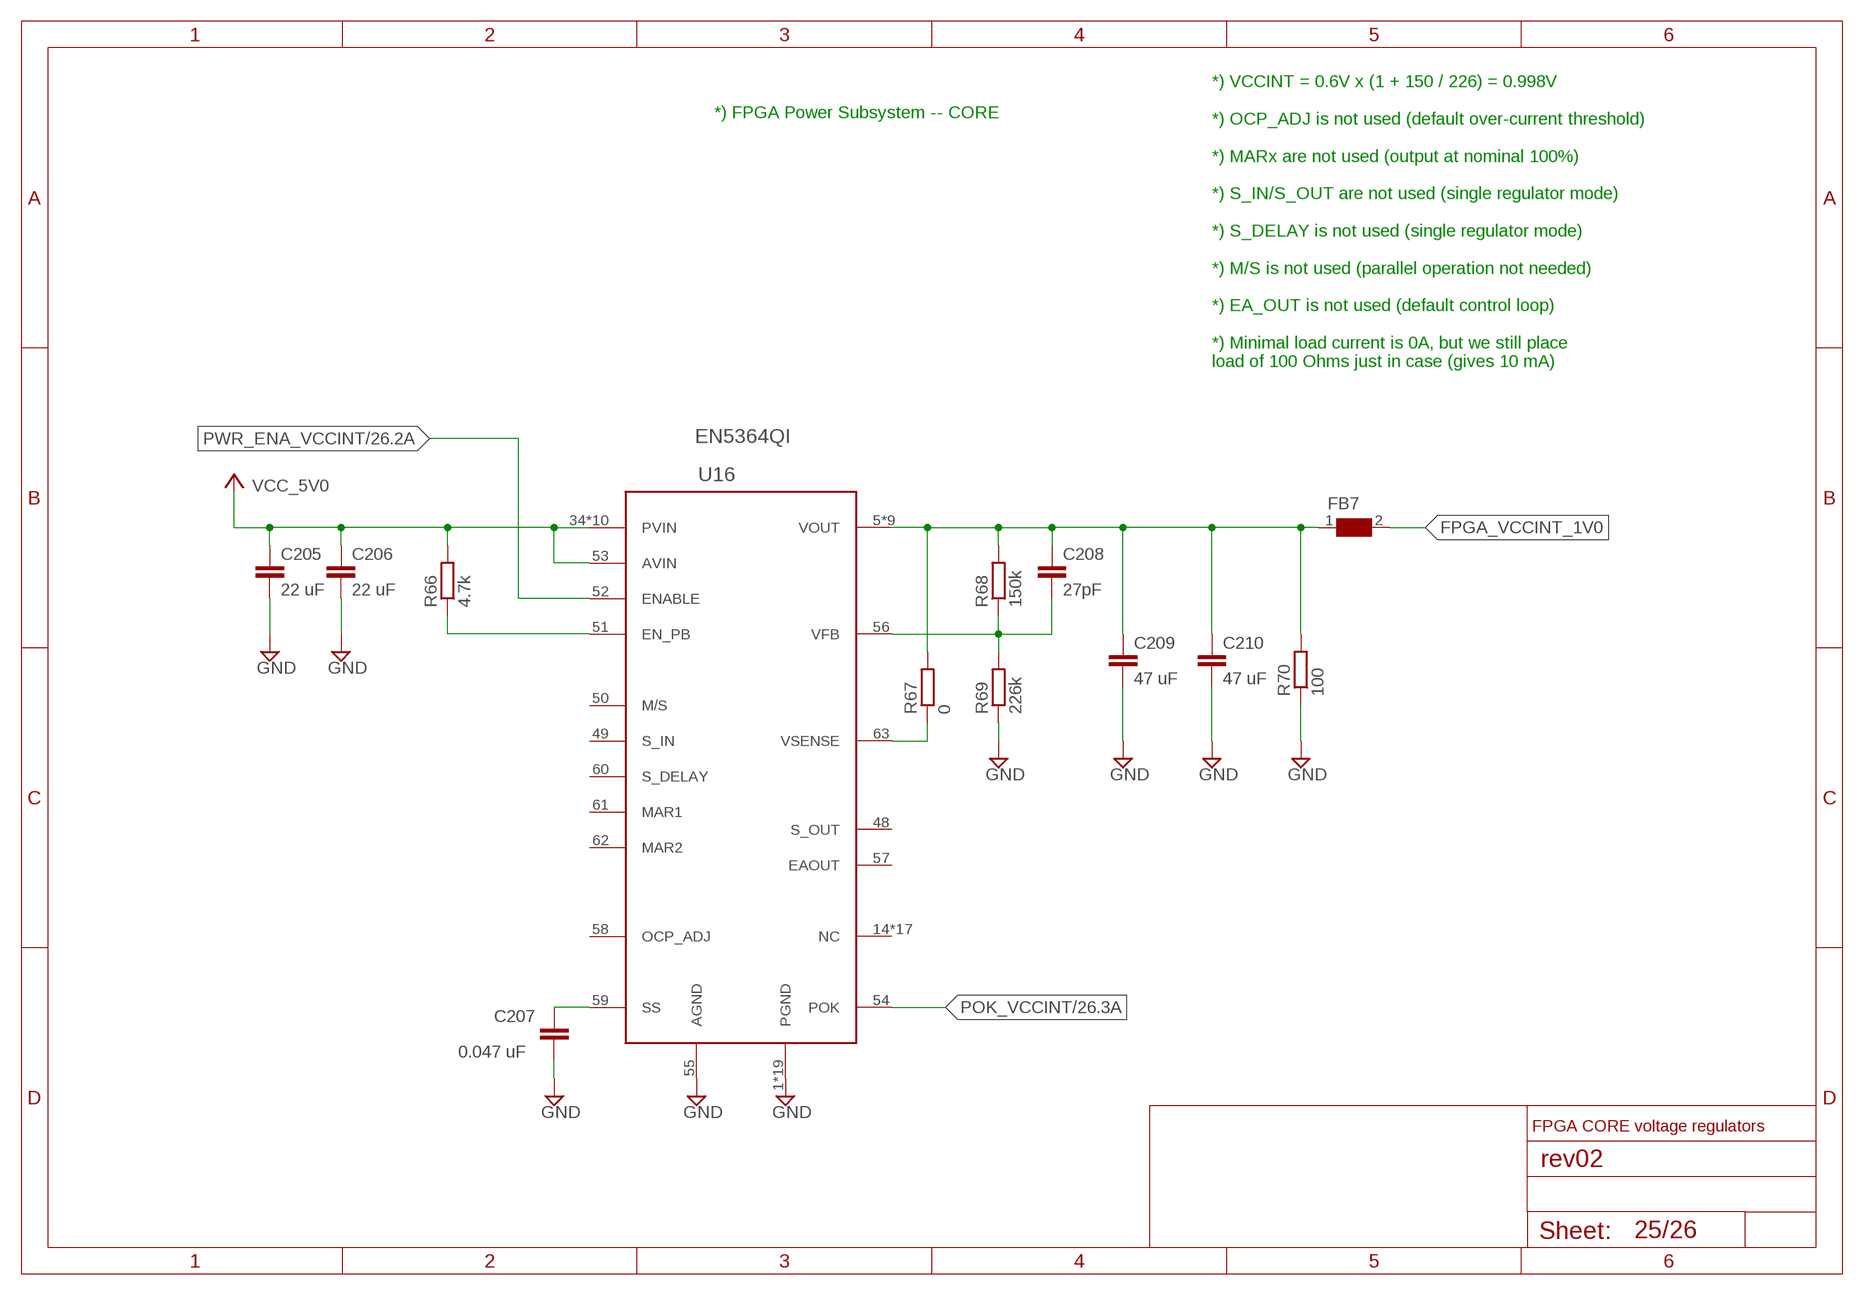
[diagram p24: schematic, sheet 25]

### Parts
C205  22 uF  C-EUC1210  [C1210]
C206  22 uF  C-EUC1210  [C1210]
C207  0.047 uF  C-EUC0402  [C0402]
C208  27pF  C-EUC0402  [C0402]
C209  47 uF  C-EUC1210  [C1210]
C210  47 uF  C-EUC1210  [C1210]
FB7  0  BLM31PG330SN1_1206  [1206]
R66  4.7k  R-EU_R0402  [R0402]
R67  0  R-EU_R0402  [R0402]
R68  150k  R-EU_R0402  [R0402]
R69  226k  R-EU_R0402  [R0402]
R70  100  R-EU_R0402  [R0402]
U16  EN5364QI  [QFN68_8X11X1.85]

### Nets
FPGA_VCCINT_1V0: FB7.2 ; also sheet 22,23
GND [Ground]: C205.2 C206.2 C207.2 C209.2 C210.2 R69.1 R70.1 U16.1(PGND) U16.2(PGND) U16.3(PGND) U16.4(PGND) U16.27(PGND) U16.28(PGND) U16.29(PGND) U16.30(PGND) U16.31(PGND) U16.32(PGND) U16.33(PGND) U16.55(AGND) U16.64(PGND) U16.65(PGND) U16.66(PGND) U16.67(PGND) U16.68(PGND) U16.P$69(PGND) U16.P$70(PGND) U16.P$71(PGND) ; also sheet 2,3,4,5,7,8,9,10,11,12,13,14,15,16,19,20,22,23,24,26
N$45: C207.1 U16.59(SS)
N$46: R66.1 U16.51(EN_PB)
N$47: R67.1 U16.63(VSENSE)
N$48: C208.1 C209.1 C210.1 FB7.1 R67.2 R68.2 R70.2 U16.5(VOUT) U16.6(VOUT) U16.7(VOUT) U16.8(VOUT) U16.9(VOUT) U16.10(VOUT) U16.11(VOUT) U16.12(VOUT) U16.13(VOUT)
N$49: C208.2 R68.1 R69.2 U16.56(VFB)
POK_VCCINT: U16.54(POK) ; also sheet 26
PWR_ENA_VCCINT: U16.52(ENABLE) ; also sheet 26
VCC_5V0: C205.1 C206.1 R66.2 U16.34(PVIN) U16.35(PVIN) U16.36(PVIN) U16.37(PVIN) U16.38(PVIN) U16.39(PVIN) U16.40(PVIN) U16.41(PVIN) U16.42(PVIN) U16.43(PVIN) U16.53(AVIN) ; supply symbol labelled VCC ; also sheet 2,19,26
Unconnected: U16.14(NC) U16.15(NC) U16.16(NC) U16.17(NC) U16.18(NC) U16.19(NC) U16.20(NC) U16.21(NC) U16.22(NC) U16.23(NC) U16.24(NC) U16.25(NC) U16.26(NC) U16.44(NC) U16.45(NC) U16.46(NC) U16.47(NC) U16.48(S_OUT) U16.49(S_IN) U16.50(M/S) U16.57(EAOUT) U16.58(OCP_ADJ) U16.60(S_DELAY) U16.61(MAR1) U16.62(MAR2)

### Notes on the sheet
- *) FPGA Power Subsystem -- CORE
- *) VCCINT = 0.6V x (1 + 150 / 226) = 0.998V
  
  *) OCP_ADJ is not used (default over-current threshold)
  
  *) MARx are not used (output at nominal 100%)
  
  *) S_IN/S_OUT are not used (single regulator mode)
  
  *) S_DELAY is not used (single regulator mode)
  
  *) M/S is not used (parallel operation not needed)
  
  *) EA_OUT is not used (default control loop)
  
  *) Minimal load current is 0A, but we still place
  load of 100 Ohms just in case (gives 10 mA)
- FPGA CORE voltage regulators

## Sheet 26 of 26: FPGA power sequencing
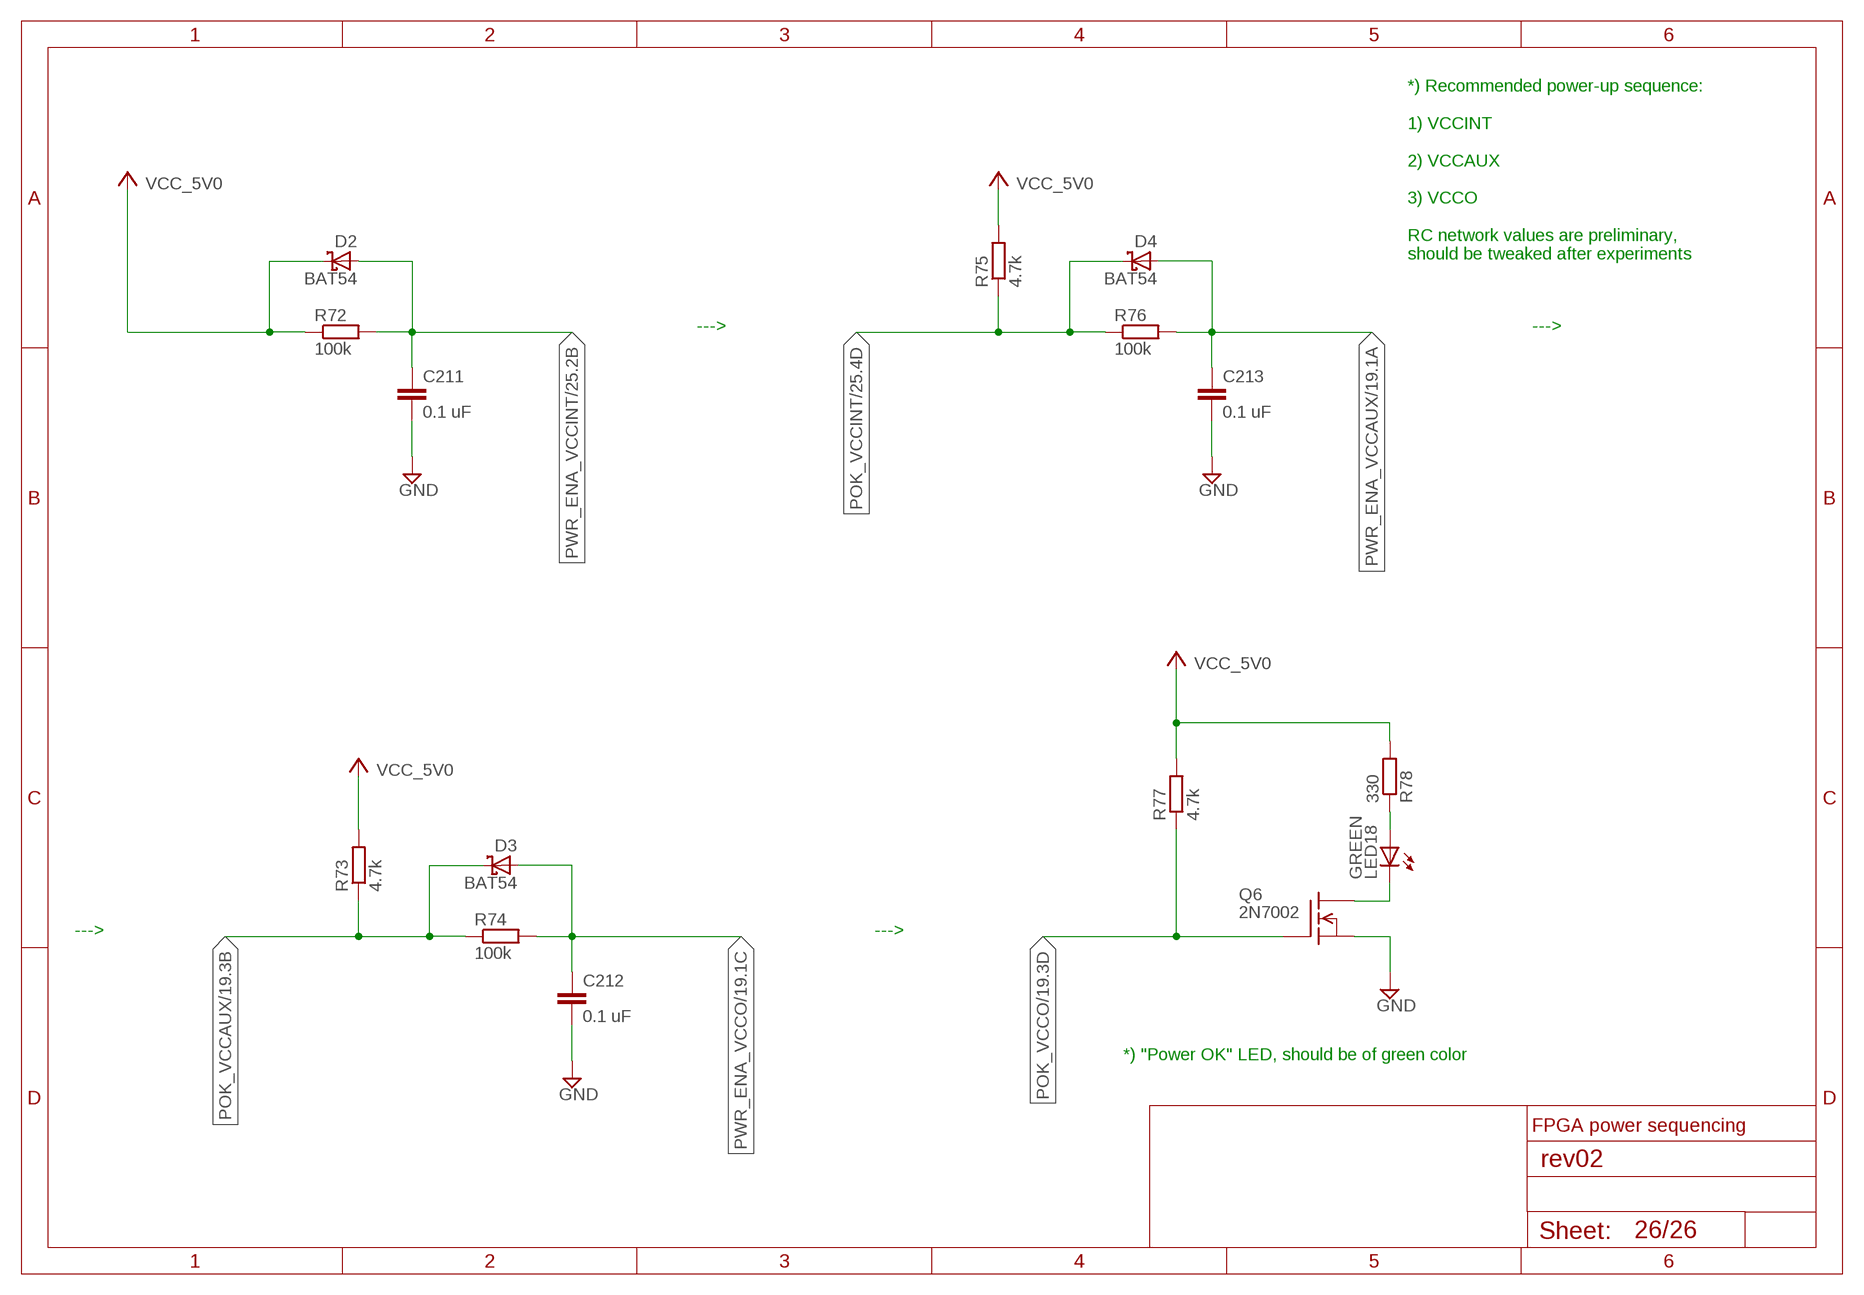
[diagram p25: schematic, sheet 26]

### Parts
C211  0.1 uF  C-EUC0402  [C0402]
C212  0.1 uF  C-EUC0402  [C0402]
C213  0.1 uF  C-EUC0402  [C0402]
D2  BAT54  [SOT23]
D3  BAT54  [SOT23]
D4  BAT54  [SOT23]
LED18  GREEN  LEDCHIP-LED0603  [CHIP-LED0603]
Q6  2N7002  [SOT23]
R72  100k  R-EU_R0402  [R0402]
R73  4.7k  R-EU_R0402  [R0402]
R74  100k  R-EU_R0402  [R0402]
R75  4.7k  R-EU_R0402  [R0402]
R76  100k  R-EU_R0402  [R0402]
R77  4.7k  R-EU_R0402  [R0402]
R78  330  R-EU_R0402  [R0402]

### Nets
GND [Ground]: C211.2 C212.2 C213.2 Q6.2(S) ; also sheet 2,3,4,5,7,8,9,10,11,12,13,14,15,16,19,20,22,23,24,25
N$50: LED18.C Q6.3(D)
N$51: LED18.A R78.1
POK_VCCAUX: D3.3(C) R73.1 R74.1 ; also sheet 19
POK_VCCINT: D4.3(C) R75.1 R76.1 ; also sheet 25
POK_VCCO: Q6.1(G) R77.1 ; also sheet 19
PWR_ENA_VCCAUX: C213.1 D4.1(A) R76.2 ; also sheet 19
PWR_ENA_VCCINT: C211.1 D2.1(A) R72.2 ; also sheet 25
PWR_ENA_VCCO: C212.1 D3.1(A) R74.2 ; also sheet 19
VCC_5V0: D2.3(C) R72.1 R73.2 R75.2 R77.2 R78.2 ; supply symbol labelled VCC ; also sheet 2,19,25

### Notes on the sheet
- *) Recommended power-up sequence:
  
  1) VCCINT
  
  2) VCCAUX
  
  3) VCCO
  
  RC network values are preliminary,
  should be tweaked after experiments
- ---> | --->
- ---> | --->
- *) "Power OK" LED, should be of green color
- FPGA power sequencing

## Library data of the parts
C1-C4 C6 C14-C16 C69 C108 C109 C111 C112 C115 C116 C121 C122 C207 C211-C213 = resistor:C-EU: CAPACITOR, European symbol; DIELECTRIC: X7R; RATED_VOLTAGE: 50V; TOLERANCE: 10%
C5 C132 C136 C139-C141 C144 C145 C148 C149 C152 C153 C156 C157 C160 C161 C169-C180 = resistor:C-EU: CAPACITOR, European symbol; DIELECTRIC: X5R; RATED_VOLTAGE: 16V; TOLERANCE: 10%
C7 C13 = resistor:C-EU: CAPACITOR, European symbol; DIELECTRIC: X7R; RATED_VOLTAGE: 25V
C8 C113 C114 C119 C120 C126 C133 C137 C165-C168 C205 C206 C209 C210 = resistor:C-EU: CAPACITOR, European symbol; DIELECTRIC: X5R; RATED_VOLTAGE: 16V; TOLERANCE: 20%
C9 C10 = rc-master:CP_: POLARIZED CAP; RATED_VOLTAGE: 10V; TOLERANCE: 20%
C11 C12 = rcl:C-EU: CAPACITOR, European symbol; DIELECTRIC: C0G; RATED_VOLTAGE: 25V
C17 C18 = rcl:C-EU: CAPACITOR, European symbol; DIELECTRIC: C0G
C19-C68 C72-C74 C76 C77 C79-C89 C91 C92 C94-C107 C110 C214 C215 = resistor:C-EU: CAPACITOR, European symbol; DIELECTRIC: X7R; RATED_VOLTAGE: 10V
C70 C71 C75 C78 C90 C93 = resistor:C-EU: CAPACITOR, European symbol; DIELECTRIC: C0G; RATED_VOLTAGE: 10V
C117 C118 C208 = resistor:C-EU: CAPACITOR, European symbol; DIELECTRIC: C0G; RATED_VOLTAGE: 50V; TOLERANCE: 5%
C123 C127 = resistor:CPOL-EU: POLARIZED CAPACITOR, European symbol; DIELECTRIC: TANTALUM; RATED_VOLTAGE: 6.3V; TOLERANCE: 10%
C124 C125 C128-C131 C134 C135 C138 C142 C143 C146 C147 C150 C151 C154 C155 C158 C159 C162-C164 C181-C204 = resistor:C-EU: CAPACITOR, European symbol; DIELECTRIC: X5R; RATED_VOLTAGE: 6.3V; TOLERANCE: 10%
CN1 CN2 = adafruit:USB: USB Connectors USBMINIB - Surface Mount Female Mini-B USB Connector 4UConnector: 06564 By microbuilder.eu Thru-hole RA Female Mini-B USB Connector 4UConnector: 18732 By ladyada.net
D1-D4 = diode:BAT54: Schottky Diodes Source: Fairchild .. BAT54.pdf
FB1-FB4 = microbuilder:FERRITE: Ferrite Bead 0603 MMZ1608B121C - 120 Ohm @ 100MHz, 600mA, 0.15 Ohm DC Resistance - Digikey: 445-2164-1-ND BK1608HW121-T - 120 Ohm, 600mA Ferrite Chip - Digikey: 587-1876-2-ND 0805 HZ0805B272R-10 - 2.7K Ohm @ 100MHz, 200mA, 0.8 Ohm DC Resistance - Digikey: 240-2504-1-ND (see also Murata BLM21BD272SN1L) MMZ2012Y152B - 1.5K Ohm @ 100MHz, 500mA, 0.4 Ohm DC Resistance - Digikey: 445-1560-1-ND - Mainly for high frequency (80-400MHz) MMZ2012R102A - 1K Ohm @ 100MHz, 500mA, 0.3 Ohm DC Resistance - Digikey: 445-1555-2-ND - More general purpose (10-200MHz)
FB5-FB7 = UsedComponents:BLM31PG330SN1; MPN: BLM31PG330SN1; PACKAGE: 1206; SUPPLIER: MURATA
IC1 IC3 = altera-configdevices:N25Q128A13E; OC_DIGIKEY: 557-1562-ND; OC_FARNELL: 2253682; PRICE100_DIGIKEY: 1.30470; PRICE100_FARNELL: 5.10
IC2 IC4 = 74xx-eu:74*244: Octal BUFFER and LINE DRIVER, 3-state
IC5 IC6 = UsedComponents:RCLAMP0502A: USB protective diodes; MFR: SEMTECH; MPN: RCLAMP0502A; OC_FARNELL: 2058982
J1 = STM32-SWD-connector:STM32-SWD: STM32 SWD connector
J2 J3 = SparkFun-Connectors:M03X2: 2x3 .1" header. Shrouded, with keying- CONN-10681 SMT- CONN-11415 Pogo pins- HW-11044
JP1 = SparkFun-Connectors:POWER_JACK: Power Jack This is the standard 5.5mm barrel jack for power. The PTH is the most common, proven, reliable, footprint. The Slot footprint only works if the mill layer is transmitted to the PCB fab house so be warned. Mating wall wart : TOL-00298 (and others); PROD_ID: CONN-08106; SF_ID: PRT-12748
JP2 JP6-JP9 = jumper:JP1Q: JUMPER
JP3 = SparkFun-Connectors:AVR_SPI_PRG_6: AVR ISP 6 Pin This is the reduced ISP connector for AVR programming. Common on Arduino. This footprint will take up less PCB space and can be used with a 10-pin to 6-pin adapter such as SKU: BOB-08508 **Special note about "TEST_POINT" package. The stop mask is on the top side, so if you want your programming test points to be on the bottom of your board, make sure to place this package on the bottom side of the board. This also ensure that the orientation to program from the bottom side will be correct.
JP4 = SparkFun-Connectors:M03: Header 3 Standard 3-pin 0.1" header. Use with straight break away headers (SKU : PRT-00116), right angle break away headers (PRT-00553), swiss pins (PRT-00743), machine pins (PRT-00117), and female headers (PRT-00115). Molex polarized connector foot print use with SKU : PRT-08232 with associated crimp pins and housings.
JP5 = SparkFun-Connectors:M10: Header 10 Standard 10-pin 0.1" header. Use with straight break away headers (SKU : PRT-00116), right angle break away headers (PRT-00553), swiss pins (PRT-00743), machine pins (PRT-00117), and female headers (PRT-00115).
LED1-LED18 = led:LED: LED OSRAM: - CHIPLED LG R971, LG N971, LY N971, LG Q971, LY Q971, LO R971, LY R971 LH N974, LH R974 LS Q976, LO Q976, LY Q976 LO Q996 - Hyper CHIPLED LW Q18S LB Q993, LB Q99A, LB R99A - SideLED LS A670, LO A670, LY A670, LG A670, LP A670 LB A673, LV A673, LT A673, LW A673 LH A674 LY A675 LS A676, LA A676, LO A676, LY A676, LW A676 LS A679, LY A679, LG A679 - Hyper Micro SIDELED® LS Y876, LA Y876, LO Y876, LY Y876 LT Y87S - SmartLED LW L88C, LW L88S LB L89C, LB L89S, LG L890 LS L89K, LO L89K, LY L89K LS L896, LA L896, LO L896, LY L896 - TOPLED LS T670, LO T670, LY T670, LG T670, LP T670 LSG T670, LSP T670, LSY T670, LOP T670, LYG T670 LG T671, LOG T671, LSG T671 LB T673, LV T673, LT T673, LW T673 LH T674 LS T676, LA T676, LO T676, LY T676, LB T676, LH T676, LSB T676, LW T676 LB T67C, LV T67C, LT T67C, LS T67K, LO T67K, LY T67K, LW E67C LS E67B, LA E67B, LO E67B, LY E67B, LB E67C, LV E67C, LT E67C LW T67C LS T679, LY T679, LG T679 LS T770, LO T770, LY T770, LG T770, LP T770 LB T773, LV T773, LT T773, LW T773 LH T774 LS E675, LA E675, LY E675, LS T675 LS T776, LA T776, LO T776, LY T776, LB T776 LHGB T686 LT T68C, LB T68C - Hyper Mini TOPLED® LB M676 - Mini TOPLED Santana® LG M470 LS M47K, LO M47K, LY M47K Source: http://www.osram.convergy.de LUXEON: - LUMILED® LXK2-PW12-R00, LXK2-PW12-S00, LXK2-PW14-U00, LXK2-PW14-V00 LXK2-PM12-R00, LXK2-PM12-S00, LXK2-PM14-U00 LXK2-PE12-Q00, LXK2-PE12-R00, LXK2-PE12-S00, LXK2-PE14-T00, LXK2-PE14-U00 LXK2-PB12-K00, LXK2-PB12-L00, LXK2-PB12-M00, LXK2-PB14-N00, LXK2-PB14-P00, LXK2-PB14-Q00 LXK2-PR12-L00, LXK2-PR12-M00, LXK2-PR14-Q00, LXK2-PR14-R00 LXK2-PD12-Q00, LXK2-PD12-R00, LXK2-PD12-S00 LXK2-PH12-R00, LXK2-PH12-S00 LXK2-PL12-P00, LXK2-PL12-Q00, LXK2-PL12-R00 Source: www.luxeon.com KINGBRIGHT: KA-3528ASYC Source: www.kingbright.com
LOGO1 = SparkFun-Aesthetics:OSHW-LOGO: Open Source Hardware Logo as defined here: http://freedomdefined.org/OSHW
Q1 Q4 Q6 = transistors_gaui:2N7002
Q2 = transistor-npn:BC818*: NPN Transistor
Q3 = adafruit:XTAL-4: Classic 4-pin 3.2 x 2.5mm crystal; MPN: ABM8G-25.000MHZ-4Y-T3; OC_FARNELL: 2467848
Q5 = crystal:ASF*: CRYSTAL CLOCK OSCILLATORS 5.0 Vdc or 3.3 Vdc - LOW PROFILE ULTRA MINIATURE CERAMIC SURFACE MOUNT Source: http://www.abracon.com/Oscillators/asf1-L-L1.pdf; MF: Abracon Corporation; MPN: ASFL1-50.000MHZ-EK-T; OC_FARNELL: 2467924
R1 R2 R8-R13 R22 R26 R56-R59 R68 R69 R72 R74 R76 = resistor:R-EU_: RESISTOR, European symbol; TOLERANCE: 1%
R3 R5-R7 R15 R17-R21 R23-R25 R27-R29 R32 R35-R48 R50-R55 R60-R63 R65 R66 R70 R71 R73 R75 R77-R81 R83-R91 = resistor:R-EU_: RESISTOR, European symbol; TOLERANCE: 5%
R4 R14 R30 R33 R34 R49 R67 R82 = resistor:R-EU_: RESISTOR, European symbol
R16 R31 R64 = Panasonic-EXB-ERJ:EXB38V: Chip Resistor Array; MPN: EXB38V331JV; OC_FARNELL: 2060095; OC_NEWARK: 65T9098; PACKAGE: 0603; POWERRATING: 0.063 W/element; SUPPLIER: PANASONIC; TOLERANCE: ±5 %
S1 = WE-SHC:WE-SHC: WE-SHC Shielding cabinet
S2 = UsedComponents:TACTILE_SWITCH; OC_FARNELL: 2425618
SV1 = con-lstb:MA08-1: PIN HEADER; OC_FARNELL: unknown; OC_NEWARK: unknown
SV2 SV3 = con-lstb:MA08-2: PIN HEADER; OC_FARNELL: unknown; OC_NEWARK: unknown
T1 T2 = transistor:BC847: NPN TRANSISTOR
TP1 TP2 = testpad:TP: Test pad
U1 = Alpha-Power:LMZ13608: LMZ13608 8-A SIMPLE SWITCHER Power Module With 36-V Maximum Input Voltage http://www.ti.com/lit/ds/symlink/lmz13608.pdf; MPN: LMZ13608TZ/NOPB; OC_FARNELL: 2492265; PACKAGE: NDY (11); SUPPLIER: Texas Instruments
U2 = Alpha-Power:LT3060?-*: Micropower, Low Noise, 100mA LDO, Linear Regulator; MPN: LT3060ITS8-15#TRMPBF; OC_FARNELL: 2471073
U3 = MC74HC1G14DTT1G:MC74HC1G14DTT1G: Single Inverter with Schmitt-Trigger Input; MPN: MC74HC1G14DTT1G; OC_FARNELL: 1468757; OC_NEWARK: 71J5593; PACKAGE: SOT-23-5; SUPPLIER: ON SEMICONDUCTOR
U4 = Alpha-IC:STM32F429BIT6: STM32F429 Cortex-M4 CPU 180 MHz, 256 KB RAM, 2 MB Flash; OC_FARNELL: 2469581
U5 U6 = Alpha-IC:IS45S32160F: 16Mx32, 512Mb SDRAM Clock frequency: 166, 143 MHz; MPN: IS45S32160F; SUPPLIER: ISSI
U7 = MCP79412:MCP79412-I/SN: RTCC, I2C, 1K EE, 64B SRAM, 8SOIC; MPN: MCP79412-I/SN; OC_FARNELL: 2103565; OC_NEWARK: 94T5863; PACKAGE: SOIC-8; SUPPLIER: Microchip
U8 U9 = Alpha-IC:FT232H_SERIAL: INTERFACE, USB - UART/FIFO; OC_FARNELL: 1870924
U10 = ATMEL-ATTINY828R-AU:ATTINY828R-AU: IC, MCU, 8KB, FLASH, 20MHZ, TQFP-32; MPN: ATTINY828R-AU; OC_FARNELL: 2249850; OC_NEWARK: Unknown; PACKAGE: TQFP-32; SUPPLIER: ATMEL
U12 = Microchip-23K640-I_SN:23K640-I/SN: 64K SPI Bus Low-Power Serial SRAM,SOIC-8; MPN: 23K640-I/SN; OC_FARNELL: 1695549; OC_NEWARK: 71P4706; PACKAGE: SOIC-8; SUPPLIER: MICROCHIP
U13 = Xilinx_XC7A200TFBG484:XC7A200TFBG484: Xilinx FPGA: XC7A200TFBG484; MFR: Xilinx; MPN: XC7A200T-1FBG484C; OC_DIGIKEY: 122-1871-ND
U14 U15 = Alpha-Power:EN6347QI: 3A PowerSoC Voltage Mode Synchronous PWM Buck with Integrated Inductor; MPN: EN6347QI; OC_FARNELL: 2081146; PACKAGE: QFN; SUPPLIER: ENPIRION
U16 = Alpha-Power:EN5364QI: 6A PowerSoC Voltage Mode Synchronous Buck PWM DC-DC Converter With Integrated Inductor; MPN: EN5364QI; OC_FARNELL: 2081142; PACKAGE: QFN; SUPPLIER: ENPIRION
X1 = adafruit:XTAL: Low cost SMT crystals, no capacitors included http://www.ladyada.net/library/eagle; MPN: ABS07-32.768KHZ-T; OC_FARNELL: 2101347
Y1 Y2 = microbuilder:CRYSTAL: Crystals HC49UP - Surface Mount Crystal 4.0MHz 18pF +/-30ppm Surface Mount Crystal [Digikey: 535-9857-1-ND] 12.0 MHz Surface Mount Crystal [Digikey: 535-9869-6-ND] 25.0 MHz Surface Mount Crystal [Digikey: 535-9078-1-ND] 2.5 x 2.0mm - MEMs SMT Crystal 16.0 MHz 10pF 20ppm 2.5 x 2.0mm Crystal [Digikey -40-85°C: 535-10923-1-ND] 3.2 x 2.5mm - MEMs SMT Crystal 12.0 MHz 8pF 15ppm 3.2 x 2.5mm Crystal [Digikey: -10-70°C: 644-1047-1-ND -40-125°C: 644-1128-1-ND] 16.0 MHz 8pF 15ppm 3.2 x 2.5mm Crystal [Digikey: -10-70°C: 644-1049-1-ND -40-125°C: 644-1129-2-ND] 16.0 MHz 10pF 10ppm 3.2 x 2.5mm Crystal [Digikey: 644-1100-1-ND] 27.12 MHz 18pF 30ppm 3.2 x 2.5mm Crystal [Digikey: 887-1424-1-ND] 27.12MHz 10pF 10ppm 3.2 x 2.5mm Crystal [Digikey: 887-1329-1-ND] 4.9 x 1.8mm - MEMs SMT Crystal 32.768 KHz 12.5pF 20ppm 4.9 x 1.8mm Crystal [Digikey: SE2415CT-ND] 8.0 x 3.8mm - Surface Mount Crystal 32.768kHz 12.5pF 20ppm -40°C-85°C [Digikey: 535-9166-2-ND] Cylinder 32.768KHz Cylinder Crystal (2x6mm body) [Ex. Digikey: 300-8341-2-ND]; MPN: ABM8G-12.000MHZ-4Y-T3; OC_FARNELL: 2467837; SUPPLIER: ABRACON; TOLERANCE: ±30 ppm

## Net classes
1 Ground: width 0.203 mm, drill 0.508 mm